# EAGLE schematic MainECU rev11 (EAGLE 9.6.2)

## Sheet 1 of 6
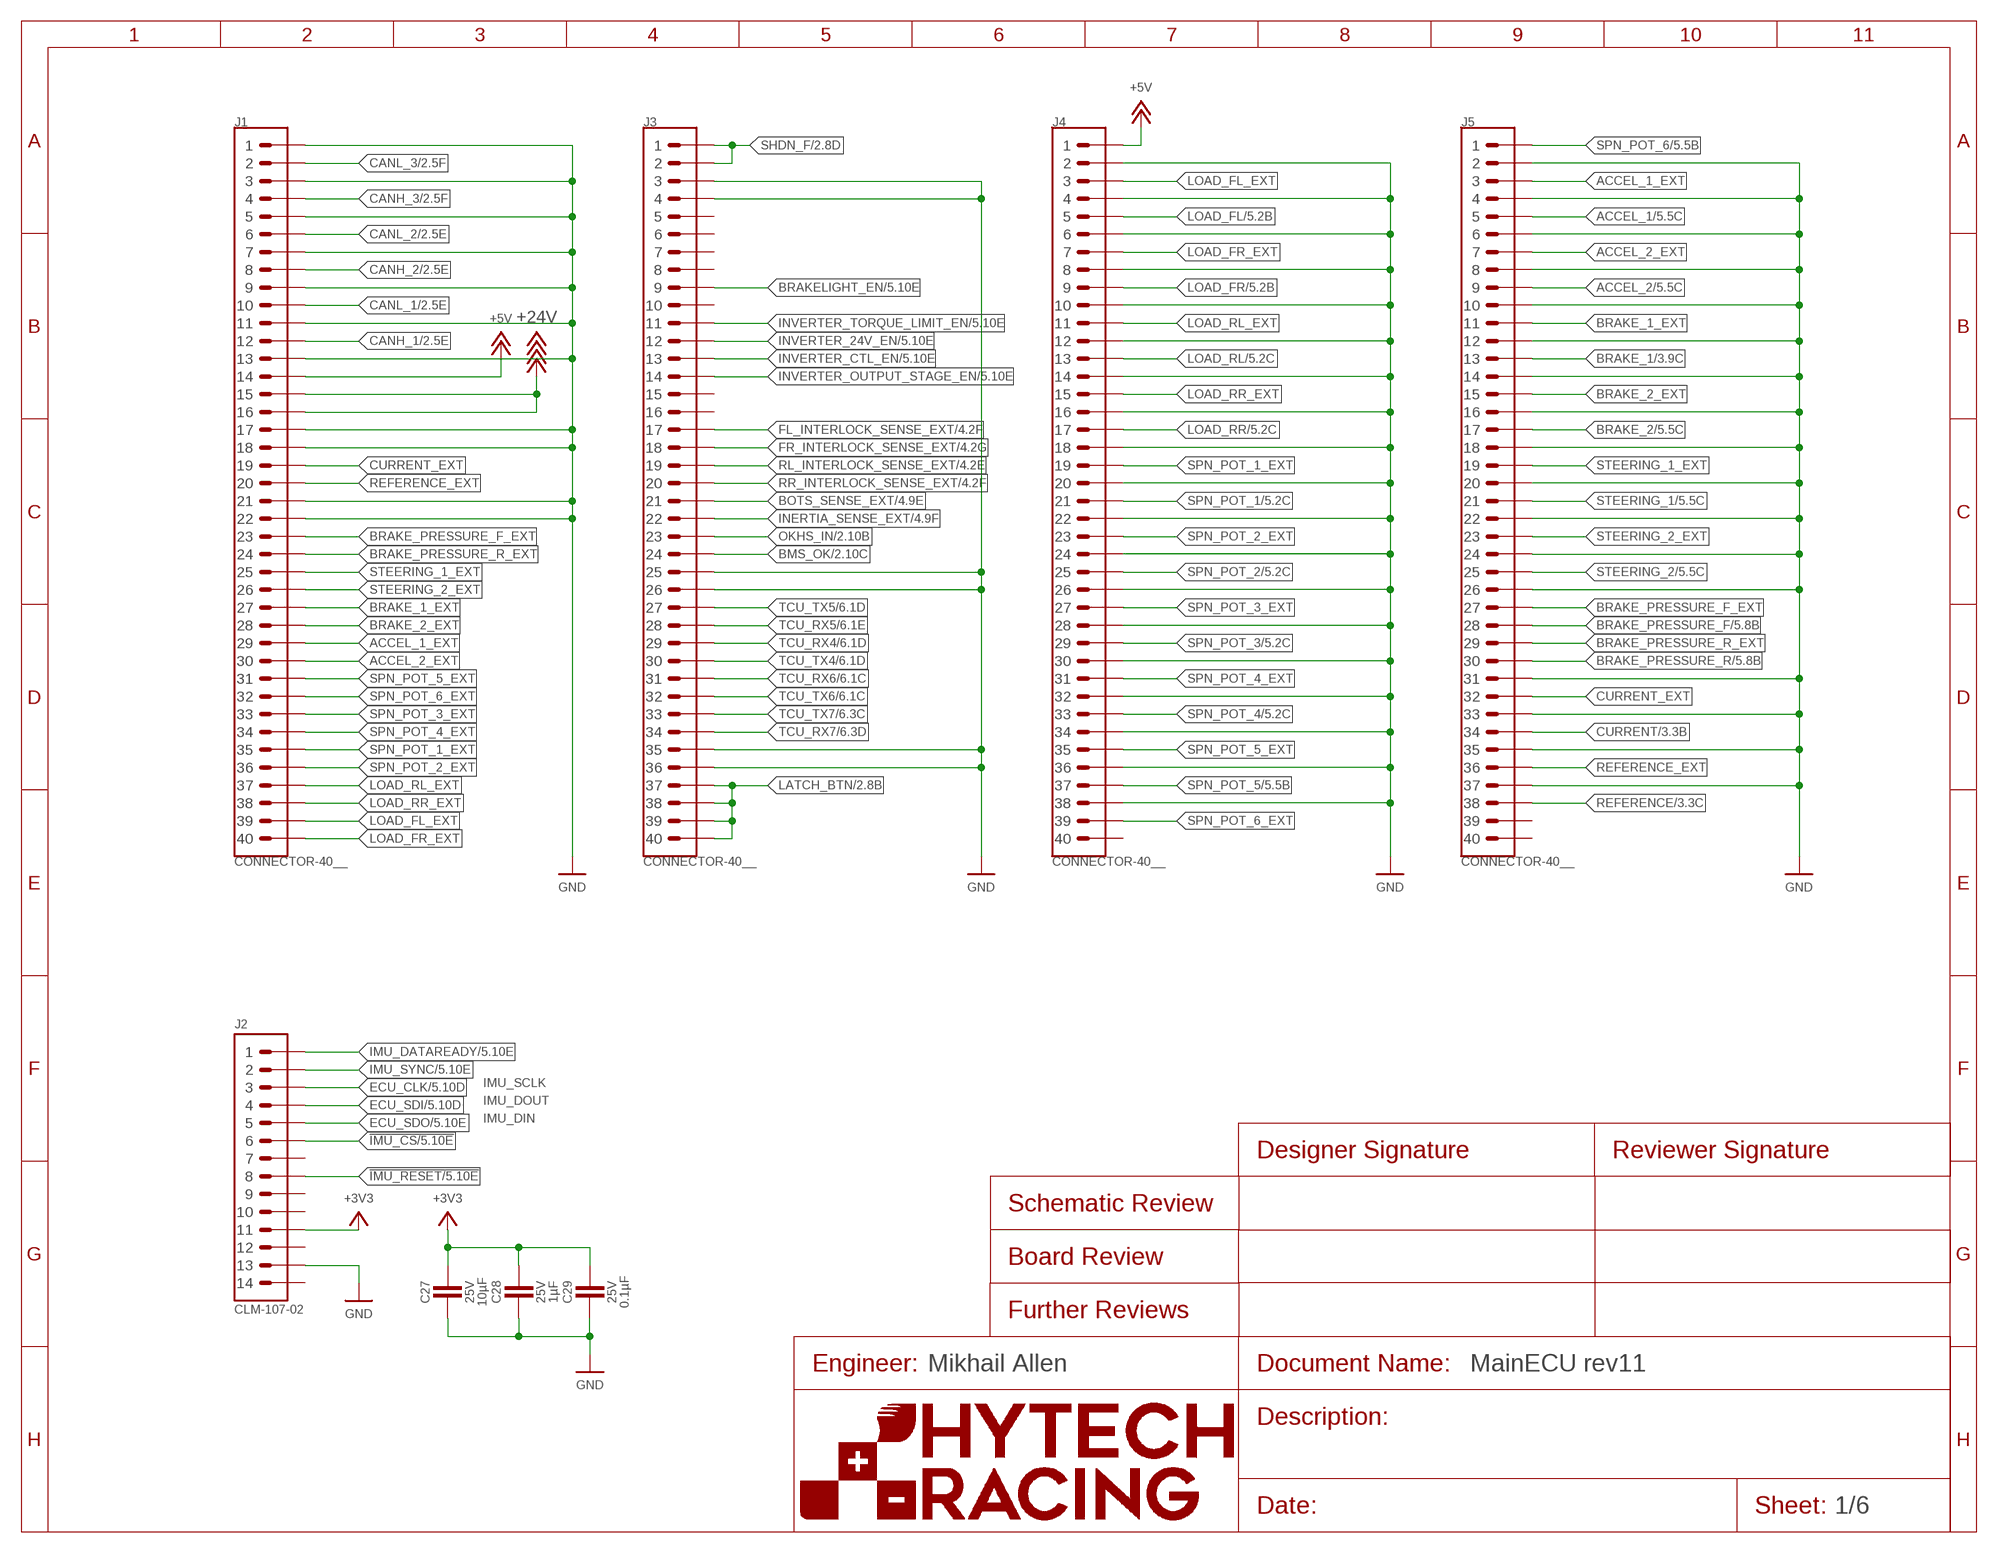
[diagram p0: schematic, sheet 1]
FRAME8 (FRAME): ENGINEER: Mikhail Allen

### Parts
C27  CAPACITOR_0603_25V_10UF  [0603-CAP]
C28  CAPACITOR_0603_25V_1UF  [0603-CAP]
C29  CAPACITOR_0603_25V_0.1UF  [0603-CAP]
J1  CONNECTOR-40__  [EHT-120-01]
J2  ADIS16460  [ADIS16460]
J3  CONNECTOR-40__  [EHT-120-01]
J4  CONNECTOR-40__  [EHT-120-01]
J5  CONNECTOR-40__  [EHT-120-01]

### Nets
!IMU_CS: J2.6 ; also sheet 5
!IMU_RESET: J2.8 ; also sheet 5
+3V3: C27.1 C28.1 C29.1 J2.11 ; also sheet 2,4,5,6
+5V: J1.14 J4.1 ; also sheet 2,3,5,6
+24V: J1.15 J1.16 ; also sheet 2,3,4,6
ACCEL_1: J5.5 ; also sheet 5
ACCEL_1_EXT: J1.29 J5.3
ACCEL_2: J5.9 ; also sheet 5
ACCEL_2_EXT: J1.30 J5.7
BMS_OK: J3.24 ; also sheet 2,4
BOTS_SENSE_EXT: J3.21 ; also sheet 4
BRAKE_1: J5.13 ; also sheet 3,5
BRAKE_1_EXT: J1.27 J5.11
BRAKE_2: J5.17 ; also sheet 5
BRAKE_2_EXT: J1.28 J5.15
BRAKE_PRESSURE_F: J5.28 ; also sheet 5
BRAKE_PRESSURE_F_EXT: J1.23 J5.27
BRAKE_PRESSURE_R: J5.30 ; also sheet 5
BRAKE_PRESSURE_R_EXT: J1.24 J5.29
BRAKELIGHT_EN: J3.9 ; also sheet 5
CANH_1: J1.12 ; also sheet 2,5,6
CANH_2: J1.8 ; also sheet 2,5,6
CANH_3: J1.4 ; also sheet 2,5,6
CANL_1: J1.10 ; also sheet 2,5,6
CANL_2: J1.6 ; also sheet 2,5,6
CANL_3: J1.2 ; also sheet 2,5,6
CURRENT: J5.34 ; also sheet 3,5,6
CURRENT_EXT: J1.19 J5.32
ECU_CLK: J2.3 ; also sheet 5
ECU_SDI: J2.4 ; also sheet 5
ECU_SDO: J2.5 ; also sheet 5
FL_INTERLOCK_SENSE_EXT: J3.17 ; also sheet 4
FR_INTERLOCK_SENSE_EXT: J3.18 ; also sheet 4
GND: C27.2 C28.2 C29.2 J1.1 J1.3 J1.5 J1.7 J1.9 J1.11 J1.13 J1.17 J1.18 J1.21 J1.22 J2.13 J3.3 J3.4 J3.25 J3.26 J3.35 J3.36 J4.2 J4.4 J4.6 J4.8 J4.10 J4.12 J4.14 J4.16 J4.18 J4.20 J4.22 J4.24 J4.26 J4.28 J4.30 J4.32 J4.34 J4.36 J4.38 J5.2 J5.4 J5.6 J5.8 J5.10 J5.12 J5.14 J5.16 J5.18 J5.20 J5.22 J5.24 J5.26 J5.31 J5.33 J5.35 J5.37 ; also sheet 2,3,4,5,6
IMU_DATAREADY: J2.1 ; also sheet 5
IMU_SYNC: J2.2 ; also sheet 5
INERTIA_SENSE_EXT: J3.22 ; also sheet 4
INVERTER_24V_EN: J3.12 ; also sheet 5
INVERTER_CTL_EN: J3.13 ; also sheet 5
INVERTER_OUTPUT_STAGE_EN: J3.14 ; also sheet 5
INVERTER_TORQUE_LIMIT_EN: J3.11 ; also sheet 5
LATCH_BTN: J3.37 J3.38 J3.39 J3.40 ; also sheet 2,4
LOAD_FL: J4.5 ; also sheet 5
LOAD_FL_EXT: J1.39 J4.3
LOAD_FR: J4.9 ; also sheet 5
LOAD_FR_EXT: J1.40 J4.7
LOAD_RL: J4.13 ; also sheet 5
LOAD_RL_EXT: J1.37 J4.11
LOAD_RR: J4.17 ; also sheet 5
LOAD_RR_EXT: J1.38 J4.15
OKHS_IN: J3.23 ; also sheet 2,4
REFERENCE: J5.38 ; also sheet 3,5,6
REFERENCE_EXT: J1.20 J5.36
RL_INTERLOCK_SENSE_EXT: J3.19 ; also sheet 4
RR_INTERLOCK_SENSE_EXT: J3.20 ; also sheet 4
SHDN_F: J3.1 J3.2 ; also sheet 2,4
SPN_POT_1: J4.21 ; also sheet 5
SPN_POT_1_EXT: J1.35 J4.19
SPN_POT_2: J4.25 ; also sheet 5
SPN_POT_2_EXT: J1.36 J4.23
SPN_POT_3: J4.29 ; also sheet 5
SPN_POT_3_EXT: J1.33 J4.27
SPN_POT_4: J4.33 ; also sheet 5
SPN_POT_4_EXT: J1.34 J4.31
SPN_POT_5: J4.37 ; also sheet 5
SPN_POT_5_EXT: J1.31 J4.35
SPN_POT_6: J5.1 ; also sheet 5
SPN_POT_6_EXT: J1.32 J4.39
STEERING_1: J5.21 ; also sheet 5
STEERING_1_EXT: J1.25 J5.19
STEERING_2: J5.25 ; also sheet 5
STEERING_2_EXT: J1.26 J5.23
TCU_RX4: J3.29 ; also sheet 6
TCU_RX5: J3.28 ; also sheet 6
TCU_RX6: J3.31 ; also sheet 6
TCU_RX7: J3.34 ; also sheet 6
TCU_TX4: J3.30 ; also sheet 6
TCU_TX5: J3.27 ; also sheet 6
TCU_TX6: J3.32 ; also sheet 6
TCU_TX7: J3.33 ; also sheet 6
Unconnected: J2.7 J2.9 J2.10 J2.12 J2.14 J3.5 J3.6 J3.7 J3.8 J3.10 J3.15 J3.16 J4.40 J5.39 J5.40

### Notes on the sheet
- IMU_SCLK
- IMU_DOUT
- IMU_DIN

## Sheet 2 of 6
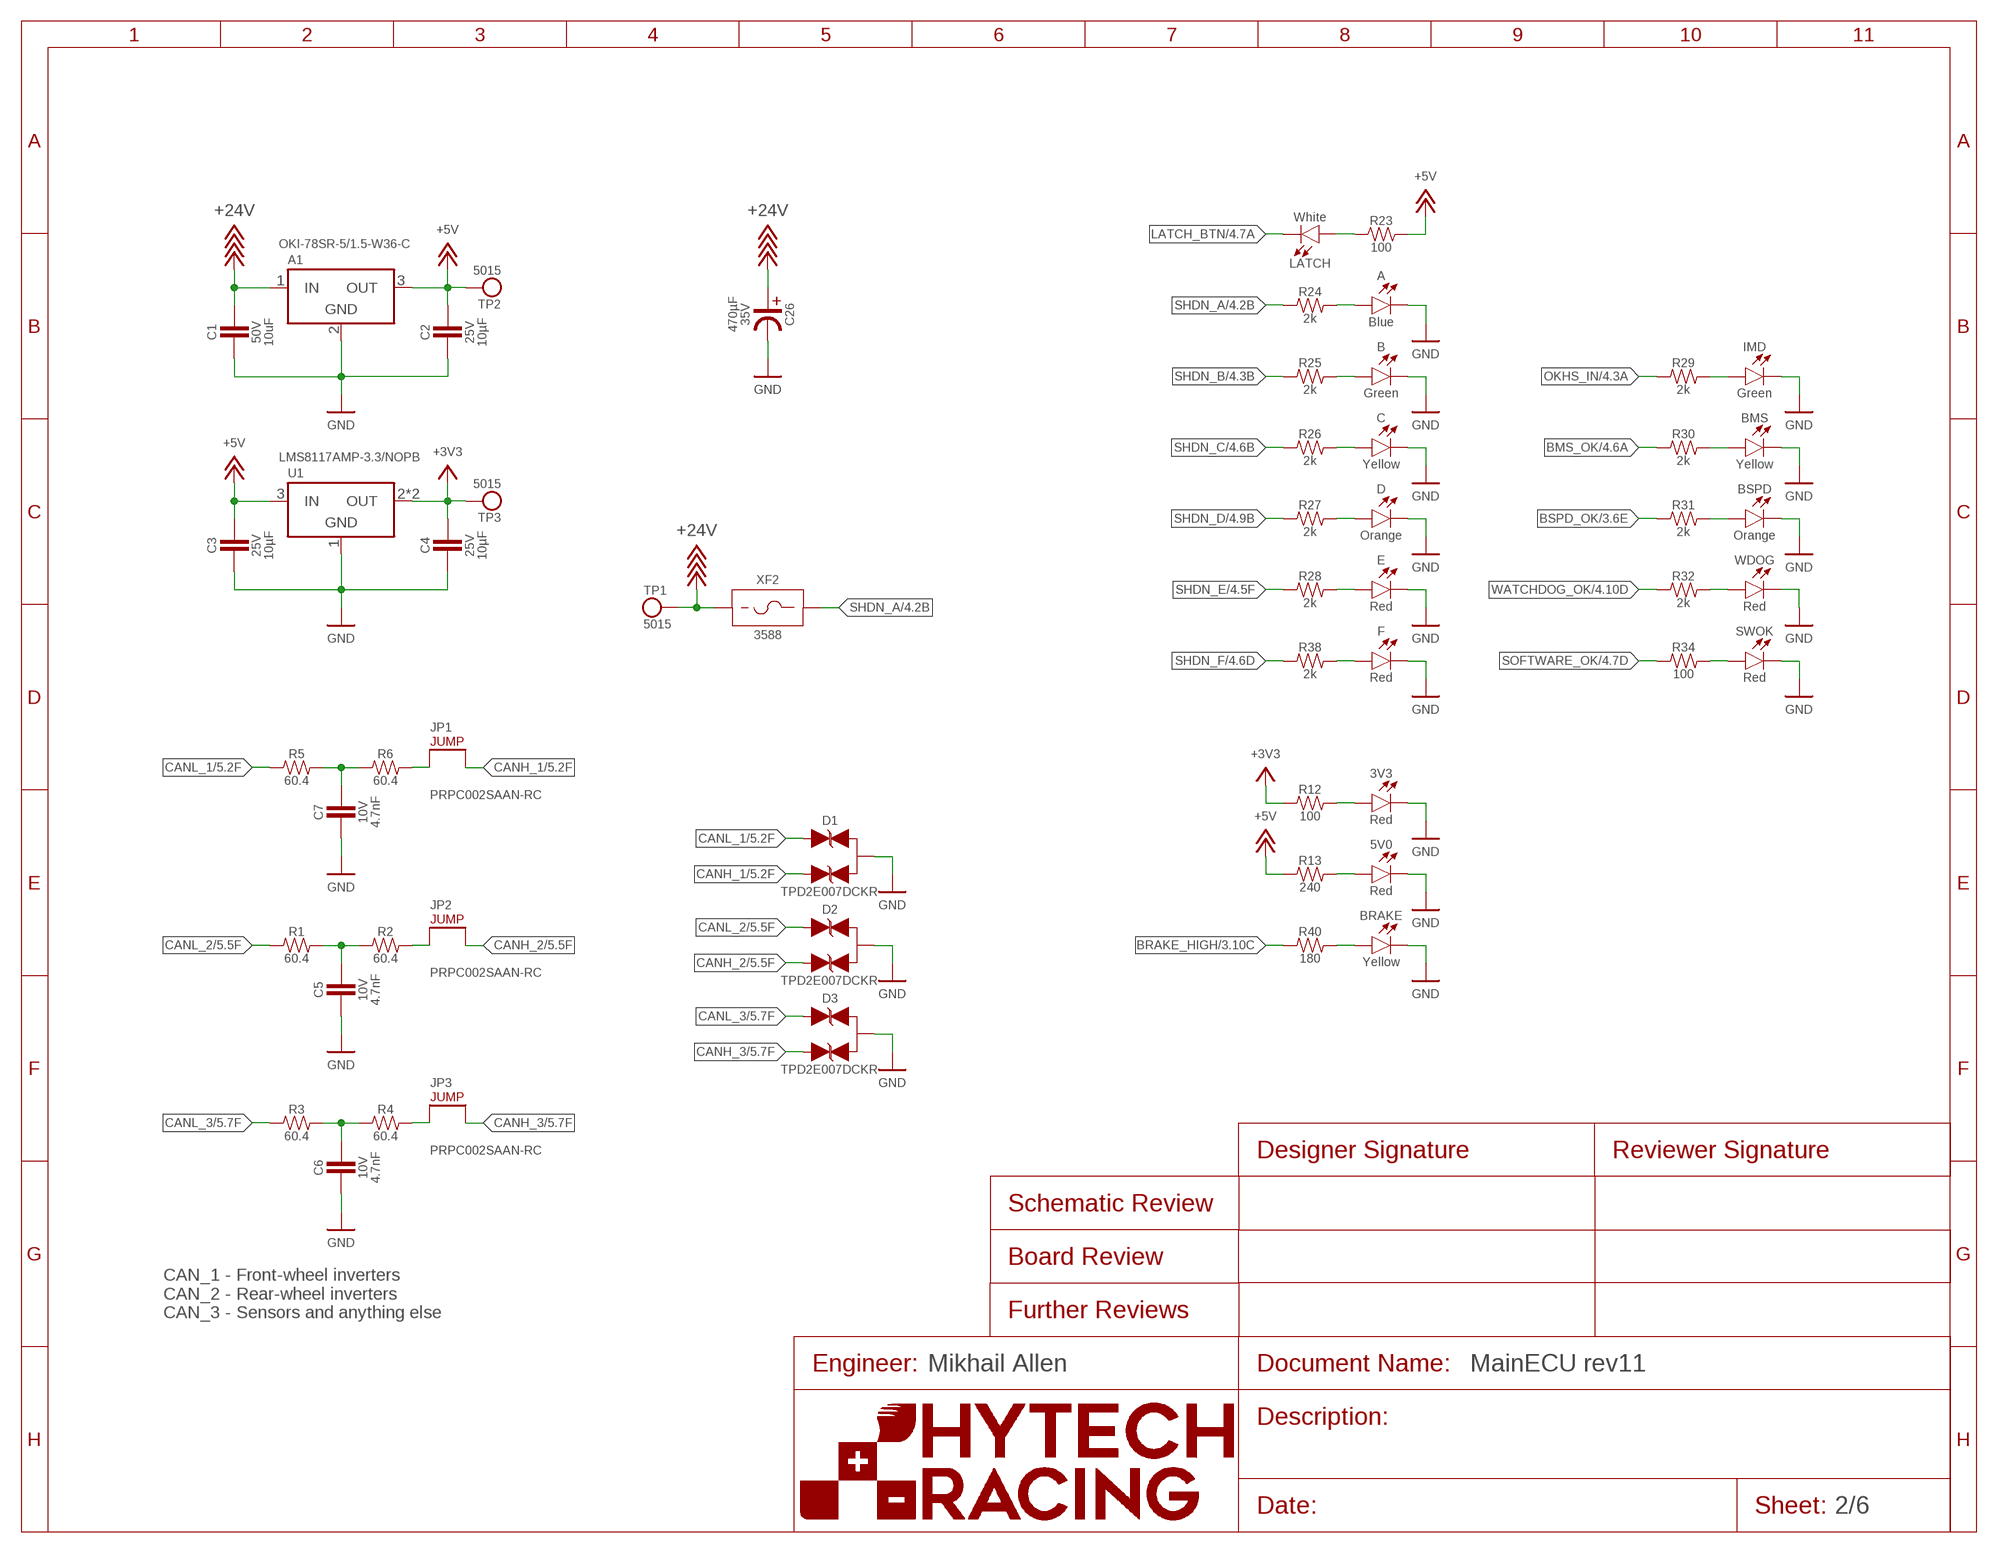
[diagram p1: schematic, sheet 2]
FRAME1 (FRAME): ENGINEER: Mikhail Allen

### Parts
3V3  LED_0603_RED  [0603-LED]
5V0  LED_0603_RED  [0603-LED]
A  LED_0603_BLUE  [0603-LED]
A1  VOLTAGE_REGULATOR_MODULE_OKI-78SR_5V  [OKI-78SR]
B  LED_0603_GREEN  [0603-LED]
BMS  LED_0603_YELLOW  [0603-LED]
BRAKE  LED_0603_YELLOW  [0603-LED]
BSPD  LED_0603_ORANGE  [0603-LED]
C  LED_0603_YELLOW  [0603-LED]
C1  CAPACITOR_0805_50V_10UF  [0805-CAP]
C2  CAPACITOR_0603_25V_10UF  [0603-CAP]
C3  CAPACITOR_0603_25V_10UF  [0603-CAP]
C4  CAPACITOR_0603_25V_10UF  [0603-CAP]
C5  CAPACITOR_0603_10V_4.7NF  [0603-CAP]
C6  CAPACITOR_0603_10V_4.7NF  [0603-CAP]
C7  CAPACITOR_0603_10V_4.7NF  [0603-CAP]
C26  EEH-AZS1V471B  [EEH-AZS]
D  LED_0603_ORANGE  [0603-LED]
D1  TVS_BIDIRECTIONAL_DUAL  [SC-70-3]
D2  TVS_BIDIRECTIONAL_DUAL  [SC-70-3]
D3  TVS_BIDIRECTIONAL_DUAL  [SC-70-3]
E  LED_0603_RED  [0603-LED]
F  LED_0603_RED  [0603-LED]
IMD  LED_0603_GREEN  [0603-LED]
JP1  JUMPER__1X02  [1X02]
JP2  JUMPER__1X02  [1X02]
JP3  JUMPER__1X02  [1X02]
LATCH  LED_0603_WHITE  [0603-LED]
R1  RESISTOR_0603_60.4  [0603-RES]
R2  RESISTOR_0603_60.4  [0603-RES]
R3  RESISTOR_0603_60.4  [0603-RES]
R4  RESISTOR_0603_60.4  [0603-RES]
R5  RESISTOR_0603_60.4  [0603-RES]
R6  RESISTOR_0603_60.4  [0603-RES]
R12  RESISTOR_0603_100  [0603-RES]
R13  RESISTOR_0603_240  [0603-RES]
R23  RESISTOR_0603_100  [0603-RES]
R24  RESISTOR_0603_2K  [0603-RES]
R25  RESISTOR_0603_2K  [0603-RES]
R26  RESISTOR_0603_2K  [0603-RES]
R27  RESISTOR_0603_2K  [0603-RES]
R28  RESISTOR_0603_2K  [0603-RES]
R29  RESISTOR_0603_2K  [0603-RES]
R30  RESISTOR_0603_2K  [0603-RES]
R31  RESISTOR_0603_2K  [0603-RES]
R32  RESISTOR_0603_2K  [0603-RES]
R34  RESISTOR_0603_100  [0603-RES]
R38  RESISTOR_0603_2K  [0603-RES]
R40  RESISTOR_0603_180  [0603-RES]
SWOK  LED_0603_RED  [0603-LED]
TP1  TEST_POINT  [5015]
TP2  TEST_POINT  [5015]
TP3  TEST_POINT  [5015]
U1  VOLTAGE_REGULATOR_SOT-223_3.3V  [SOT-223]
WDOG  LED_0603_RED  [0603-LED]
XF2  FUSE_HOLDER_MINIBLADESMD  [3588]

### Nets
+3V3: C4.1 R12.1 TP3.1 U1.2(OUT) U1.4(OUT) ; also sheet 1,4,5,6
+5V: A1.3(OUT) C2.1 C3.1 R13.1 R23.2 TP2.1 U1.3(IN) ; also sheet 1,3,5,6
+24V: A1.1(IN) C1.1 C26.PLUS TP1.1 XF2.1 XF2.2 ; also sheet 1,3,4,6
BMS_OK: R30.1 ; also sheet 1,4
BRAKE_HIGH: R40.1 ; also sheet 3
BSPD_OK: R31.1 ; also sheet 3,4
CANH_1: D1.2(C2) JP1.2 ; also sheet 1,5,6
CANH_2: D2.2(C2) JP2.2 ; also sheet 1,5,6
CANH_3: D3.2(C2) JP3.2 ; also sheet 1,5,6
CANL_1: D1.1(C1) R5.1 ; also sheet 1,5,6
CANL_2: D2.1(C1) R1.1 ; also sheet 1,5,6
CANL_3: D3.1(C1) R3.1 ; also sheet 1,5,6
GND: 3V3.1(C) 5V0.1(C) A1.2(GND) A.1(C) B.1(C) BMS.1(C) BRAKE.1(C) BSPD.1(C) C1.2 C2.2 C3.2 C4.2 C5.2 C6.2 C7.2 C26.MINUS C.1(C) D1.3(A) D2.3(A) D3.3(A) D.1(C) E.1(C) F.1(C) IMD.1(C) SWOK.1(C) U1.1(GND) WDOG.1(C) ; also sheet 1,3,4,5,6
LATCH_BTN: LATCH.1(C) ; also sheet 1,4
N$1: JP1.1 R6.2
N$2: JP2.1 R2.2
N$6: JP3.1 R4.2
N$7: C5.1 R1.2 R2.1
N$8: C6.1 R3.2 R4.1
N$9: C7.1 R5.2 R6.1
N$13: F.2(A) R38.2
N$15: LATCH.2(A) R23.1
N$16: A.2(A) R24.2
N$17: B.2(A) R25.2
N$18: C.2(A) R26.2
N$19: D.2(A) R27.2
N$20: E.2(A) R28.2
N$40: IMD.2(A) R29.2
N$41: BMS.2(A) R30.2
N$42: BSPD.2(A) R31.2
N$43: R32.2 WDOG.2(A)
N$44: 3V3.2(A) R12.2
N$45: R34.2 SWOK.2(A)
N$47: 5V0.2(A) R13.2
N$56: BRAKE.2(A) R40.2
OKHS_IN: R29.1 ; also sheet 1,4
SHDN_A: R24.1 XF2.3 XF2.4 ; also sheet 4
SHDN_B: R25.1 ; also sheet 4
SHDN_C: R26.1 ; also sheet 4
SHDN_D: R27.1 ; also sheet 4
SHDN_E: R28.1 ; also sheet 4
SHDN_F: R38.1 ; also sheet 1,4
SOFTWARE_OK: R34.1 ; also sheet 4,5
WATCHDOG_OK: R32.1 ; also sheet 4

### Notes on the sheet
- CAN_1 - Front-wheel inverters
  CAN_2 - Rear-wheel inverters
  CAN_3 - Sensors and anything else

## Sheet 3 of 6
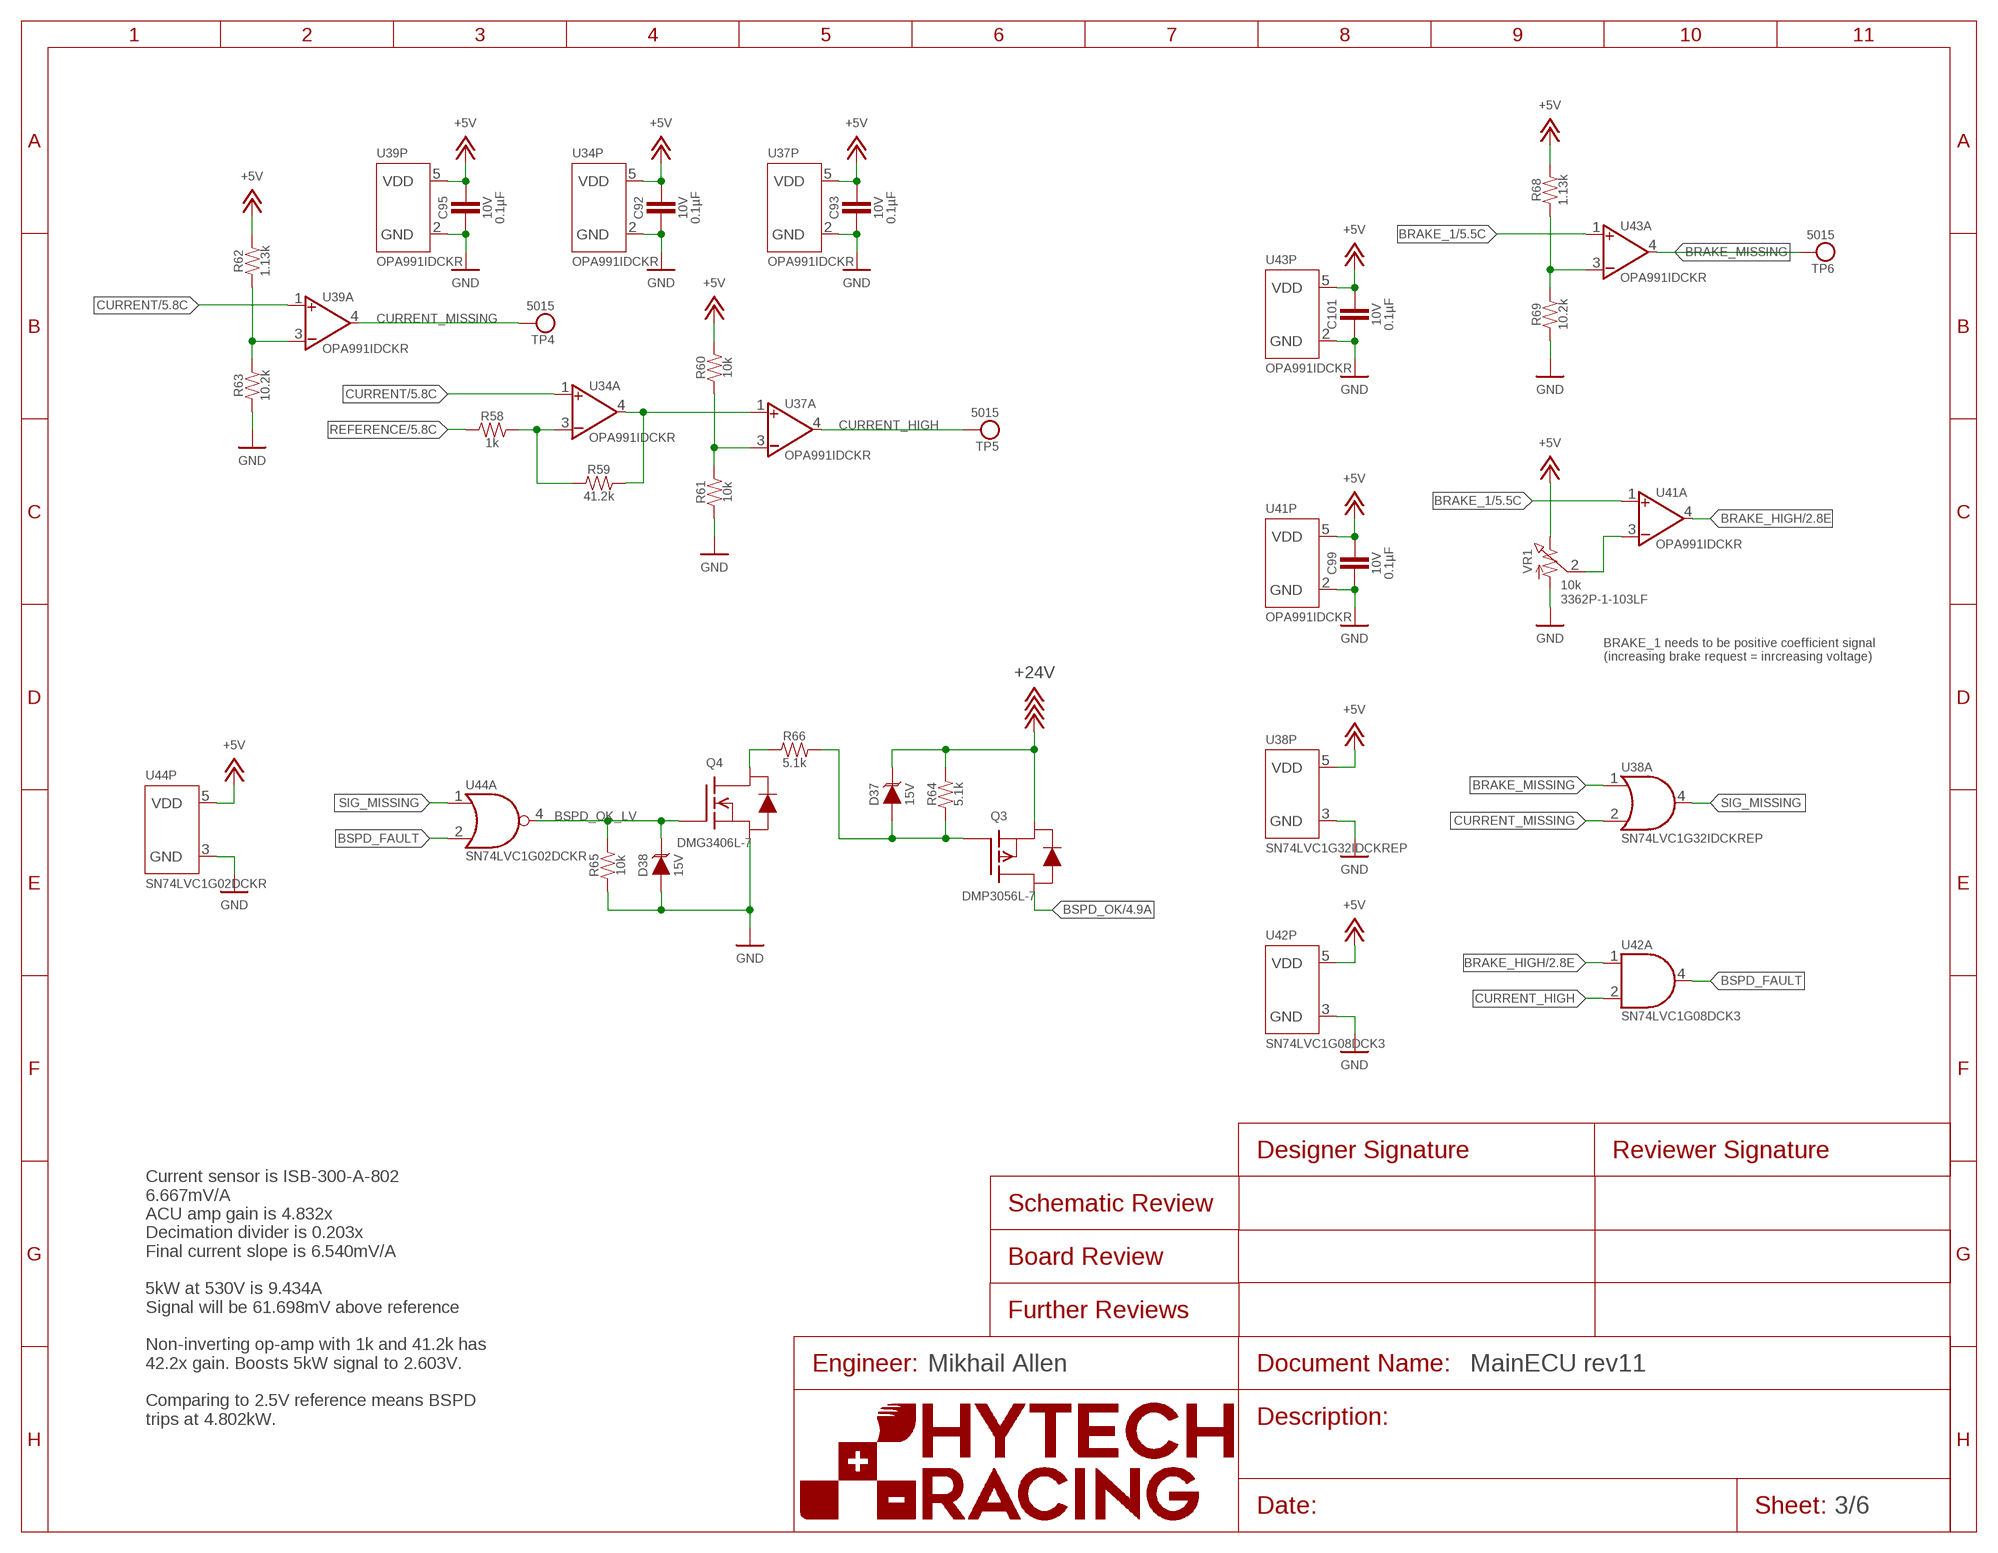
[diagram p2: schematic, sheet 3]
FRAME7 (FRAME): ENGINEER: Mikhail Allen

### Parts
C92  CAPACITOR_0603_10V_0.1UF  [0603-CAP]
C93  CAPACITOR_0603_10V_0.1UF  [0603-CAP]
C95  CAPACITOR_0603_10V_0.1UF  [0603-CAP]
C99  CAPACITOR_0603_10V_0.1UF  [0603-CAP]
C101  CAPACITOR_0603_10V_0.1UF  [0603-CAP]
D37  TVS_15V  [SOT-23]
D38  TVS_15V  [SOT-23]
Q3  TRANSISTOR_P_MOS_SOT-23_DMP3056L-7  [SOT-23]
Q4  TRANSISTOR_N_MOS__DMG3406L-7  [SOT-23]
R58  RESISTOR_0603_1K  [0603-RES]
R59  RESISTOR_0603_41.2K  [0603-RES]
R60  RESISTOR_0603_10K  [0603-RES]
R61  RESISTOR_0603_10K  [0603-RES]
R62  RESISTOR_0603_1.13K  [0603-RES]
R63  RESISTOR_0603_10.2K  [0603-RES]
R64  RESISTOR_0603_5.1K  [0603-RES]
R65  RESISTOR_0603_10K  [0603-RES]
R66  RESISTOR_0603_5.1K  [0603-RES]
R68  RESISTOR_0603_1.13K  [0603-RES]
R69  RESISTOR_0603_10.2K  [0603-RES]
TP4  TEST_POINT  [5015]
TP5  TEST_POINT  [5015]
TP6  TEST_POINT  [5015]
U34  OPAMP_1_CHANNEL_OPA991  [SC-70-5]
U37  OPAMP_1_CHANNEL_OPA991  [SC-70-5]
U38  LOGICGATE_OR  [SC-70-5]
U39  OPAMP_1_CHANNEL_OPA991  [SC-70-5]
U41  OPAMP_1_CHANNEL_OPA991  [SC-70-5]
U42  LOGICGATE_AND_DCK3  [SC-70-5]
U43  OPAMP_1_CHANNEL_OPA991  [SC-70-5]
U44  LOGICGATE_NOR  [SC-70-5]
VR1  RESISTOR_TRIMPOT_10K_3362P  [3362P]

### Nets
+5V: C92.1 C93.1 C95.1 C99.1 C101.1 R60.2 R62.2 R68.2 U34.5(P:VDD) U37.5(P:VDD) U38.5(P:VDD) U39.5(P:VDD) U41.5(P:VDD) U42.5(P:VDD) U43.5(P:VDD) U44.5(P:VDD) VR1.3 ; also sheet 1,2,5,6
+24V: D37.3(C) Q3.2(S) R64.2 ; also sheet 1,2,4,6
BRAKE_1: U41.1(A:VIN+) U43.1(A:VIN+) ; also sheet 1,5
BRAKE_HIGH: U41.4(A:VOUT) U42.1(A:IN1) ; also sheet 2
BRAKE_MISSING: TP6.1 U38.1(A:IN1) U43.4(A:VOUT)
BSPD_FAULT: U42.4(A:OUT) U44.2(A:IN2)
BSPD_OK: Q3.3(D) ; also sheet 2,4
BSPD_OK_LV: D38.3(C) Q4.1(G) R65.2 U44.4(A:OUT)
CURRENT: U34.1(A:VIN+) U39.1(A:VIN+) ; also sheet 1,5,6
CURRENT_HIGH: TP5.1 U37.4(A:VOUT) U42.2(A:IN2)
CURRENT_MISSING: TP4.1 U38.2(A:IN2) U39.4(A:VOUT)
GND: C92.2 C93.2 C95.2 C99.2 C101.2 D38.1(A) Q4.2(S) R61.1 R63.1 R65.1 R69.1 U34.2(P:GND) U37.2(P:GND) U38.3(P:GND) U39.2(P:GND) U41.2(P:GND) U42.3(P:GND) U43.2(P:GND) U44.3(P:GND) VR1.1 ; also sheet 1,2,4,5,6
N$65: R60.1 R61.2 U37.3(A:VIN-)
N$67: R58.2 R59.1 U34.3(A:VIN-)
N$68: R59.2 U34.4(A:VOUT) U37.1(A:VIN+)
N$72: R62.1 R63.2 U39.3(A:VIN-)
N$73: U41.3(A:VIN-) VR1.2
N$74: D37.1(A) Q3.1(G) R64.1 R66.2
N$75: Q4.3(D) R66.1
N$76: R68.1 R69.2 U43.3(A:VIN-)
REFERENCE: R58.1 ; also sheet 1,5,6
SIG_MISSING: U38.4(A:OUT) U44.1(A:IN1)

### Notes on the sheet
- BRAKE_1 needs to be positive coefficient signal
  (increasing brake request = inrcreasing voltage)
- Current sensor is ISB-300-A-802
  6.667mV/A
  ACU amp gain is 4.832x
  Decimation divider is 0.203x
  Final current slope is 6.540mV/A
  
  5kW at 530V is 9.434A
  Signal will be 61.698mV above reference
  
  Non-inverting op-amp with 1k and 41.2k has
  42.2x gain. Boosts 5kW signal to 2.603V.
  
  Comparing to 2.5V reference means BSPD
  trips at 4.802kW.

## Sheet 4 of 6
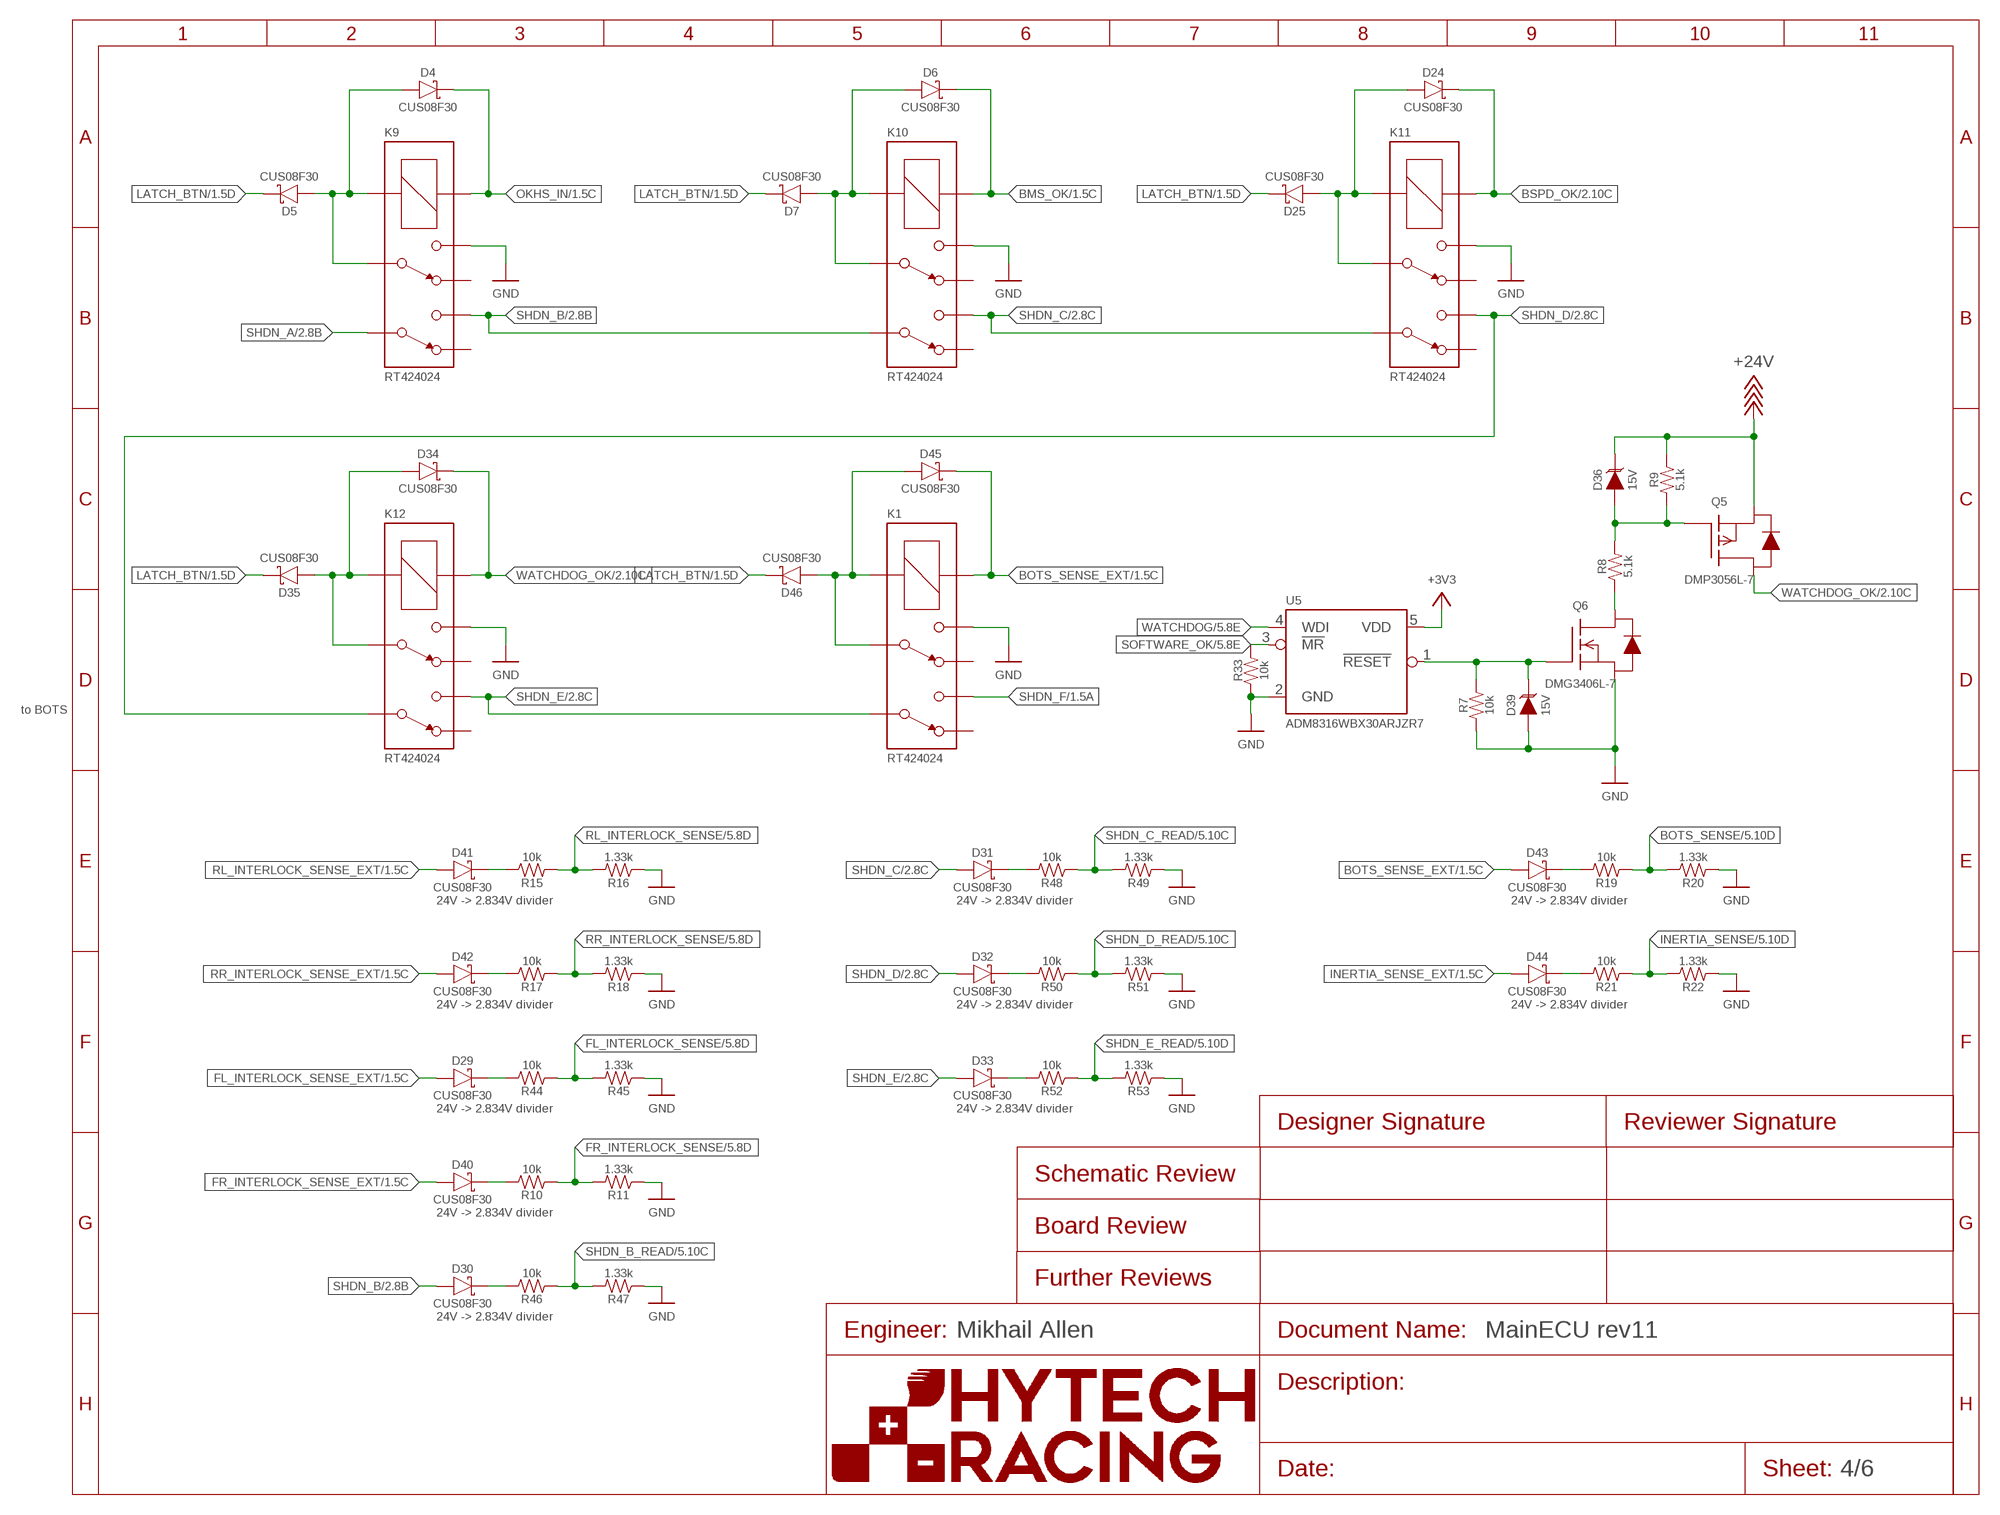
[diagram p3: schematic, sheet 4]
FRAME2 (FRAME): ENGINEER: Mikhail Allen

### Parts
D4  SCHOTTKY_SOD323_30V  [SOD-323]
D5  SCHOTTKY_SOD323_30V  [SOD-323]
D6  SCHOTTKY_SOD323_30V  [SOD-323]
D7  SCHOTTKY_SOD323_30V  [SOD-323]
D24  SCHOTTKY_SOD323_30V  [SOD-323]
D25  SCHOTTKY_SOD323_30V  [SOD-323]
D29  SCHOTTKY_SOD323_30V  [SOD-323]
D30  SCHOTTKY_SOD323_30V  [SOD-323]
D31  SCHOTTKY_SOD323_30V  [SOD-323]
D32  SCHOTTKY_SOD323_30V  [SOD-323]
D33  SCHOTTKY_SOD323_30V  [SOD-323]
D34  SCHOTTKY_SOD323_30V  [SOD-323]
D35  SCHOTTKY_SOD323_30V  [SOD-323]
D36  TVS_15V  [SOT-23]
D39  TVS_15V  [SOT-23]
D40  SCHOTTKY_SOD323_30V  [SOD-323]
D41  SCHOTTKY_SOD323_30V  [SOD-323]
D42  SCHOTTKY_SOD323_30V  [SOD-323]
D43  SCHOTTKY_SOD323_30V  [SOD-323]
D44  SCHOTTKY_SOD323_30V  [SOD-323]
D45  SCHOTTKY_SOD323_30V  [SOD-323]
D46  SCHOTTKY_SOD323_30V  [SOD-323]
K1  RELAY_DPDT_RT424024  [RT*2*]
K9  RELAY_DPDT_RT424024  [RT*2*]
K10  RELAY_DPDT_RT424024  [RT*2*]
K11  RELAY_DPDT_RT424024  [RT*2*]
K12  RELAY_DPDT_RT424024  [RT*2*]
Q5  TRANSISTOR_P_MOS_SOT-23_DMP3056L-7  [SOT-23]
Q6  TRANSISTOR_N_MOS__DMG3406L-7  [SOT-23]
R7  RESISTOR_0603_10K  [0603-RES]
R8  RESISTOR_0603_5.1K  [0603-RES]
R9  RESISTOR_0603_5.1K  [0603-RES]
R10  RESISTOR_0603_10K  [0603-RES]
R11  RESISTOR_0603_1.33K  [0603-RES]
R15  RESISTOR_0603_10K  [0603-RES]
R16  RESISTOR_0603_1.33K  [0603-RES]
R17  RESISTOR_0603_10K  [0603-RES]
R18  RESISTOR_0603_1.33K  [0603-RES]
R19  RESISTOR_0603_10K  [0603-RES]
R20  RESISTOR_0603_1.33K  [0603-RES]
R21  RESISTOR_0603_10K  [0603-RES]
R22  RESISTOR_0603_1.33K  [0603-RES]
R33  RESISTOR_0603_10K  [0603-RES]
R44  RESISTOR_0603_10K  [0603-RES]
R45  RESISTOR_0603_1.33K  [0603-RES]
R46  RESISTOR_0603_10K  [0603-RES]
R47  RESISTOR_0603_1.33K  [0603-RES]
R48  RESISTOR_0603_10K  [0603-RES]
R49  RESISTOR_0603_1.33K  [0603-RES]
R50  RESISTOR_0603_10K  [0603-RES]
R51  RESISTOR_0603_1.33K  [0603-RES]
R52  RESISTOR_0603_10K  [0603-RES]
R53  RESISTOR_0603_1.33K  [0603-RES]
U5  ADM8316WBX30  [SOT-23-5]

### Nets
+3V3: U5.5(VDD) ; also sheet 1,2,5,6
+24V: D36.3(C) Q5.2(S) R9.2 ; also sheet 1,2,3,6
BMS_OK: D6.C K10.A1(COIL+) ; also sheet 1,2
BOTS_SENSE: R19.1 R20.2 ; also sheet 5
BOTS_SENSE_EXT: D43.A D45.C K1.A1(COIL+) ; also sheet 1
BSPD_OK: D24.C K11.A1(COIL+) ; also sheet 2,3
FL_INTERLOCK_SENSE: R44.1 R45.2 ; also sheet 5
FL_INTERLOCK_SENSE_EXT: D29.A ; also sheet 1
FR_INTERLOCK_SENSE: R10.1 R11.2 ; also sheet 5
FR_INTERLOCK_SENSE_EXT: D40.A ; also sheet 1
GND: D39.1(A) K1.14 K9.14 K10.14 K11.14 K12.14 Q6.2(S) R7.1 R11.1 R16.1 R18.1 R20.1 R22.1 R33.1 R45.1 R47.1 R49.1 R51.1 R53.1 U5.2(GND) ; also sheet 1,2,3,5,6
INERTIA_SENSE: R21.1 R22.2 ; also sheet 5
INERTIA_SENSE_EXT: D44.A ; also sheet 1
LATCH_BTN: D5.C D7.C D25.C D35.C D46.C ; also sheet 1,2
N$3: D40.C R10.2
N$4: D36.1(A) Q5.1(G) R8.2 R9.1
N$5: Q6.3(D) R8.1
N$10: D41.C R15.2
N$11: D42.C R17.2
N$12: D43.C R19.2
N$14: D44.C R21.2
N$21: D4.A D5.A K9.11 K9.A2(COIL-)
N$22: D24.A D25.A K11.11 K11.A2(COIL-)
N$23: D6.A D7.A K10.11 K10.A2(COIL-)
N$24: D45.A D46.A K1.11 K1.A2(COIL-)
N$25: D34.A D35.A K12.11 K12.A2(COIL-)
N$58: D29.C R44.2
N$59: D30.C R46.2
N$60: D31.C R48.2
N$61: D32.C R50.2
N$62: D33.C R52.2
OKHS_IN: D4.C K9.A1(COIL+) ; also sheet 1,2
RL_INTERLOCK_SENSE: R15.1 R16.2 ; also sheet 5
RL_INTERLOCK_SENSE_EXT: D41.A ; also sheet 1
RR_INTERLOCK_SENSE: R17.1 R18.2 ; also sheet 5
RR_INTERLOCK_SENSE_EXT: D42.A ; also sheet 1
SHDN_A: K9.21 ; also sheet 2
SHDN_B: D30.A K9.24 K10.21 ; also sheet 2
SHDN_B_READ: R46.1 R47.2 ; also sheet 5
SHDN_C: D31.A K10.24 K11.21 ; also sheet 2
SHDN_C_READ: R48.1 R49.2 ; also sheet 5
SHDN_D: D32.A K11.24 K12.21 ; also sheet 2
SHDN_D_READ: R50.1 R51.2 ; also sheet 5
SHDN_E: D33.A K1.21 K12.24 ; also sheet 2
SHDN_E_READ: R52.1 R53.2 ; also sheet 5
SHDN_F: K1.24 ; also sheet 1,2
SOFTWARE_OK: R33.2 U5.3(!MR!) ; also sheet 2,5
WATCHDOG: U5.4(WDI) ; also sheet 5
WATCHDOG_OK: D34.C K12.A1(COIL+) Q5.3(D) ; also sheet 2
WATCHDOG_OK_LV: D39.3(C) Q6.1(G) R7.2 U5.1(!RESET!)
Unconnected: K1.12 K1.22 K9.12 K9.22 K10.12 K10.22 K11.12 K11.22 K12.12 K12.22

### Notes on the sheet
- to BOTS
- 24V -> 2.834V divider | 24V -> 2.834V divider | 24V -> 2.834V divider
- 24V -> 2.834V divider | 24V -> 2.834V divider | 24V -> 2.834V divider
- 24V -> 2.834V divider | 24V -> 2.834V divider
- 24V -> 2.834V divider
- 24V -> 2.834V divider

## Sheet 5 of 6
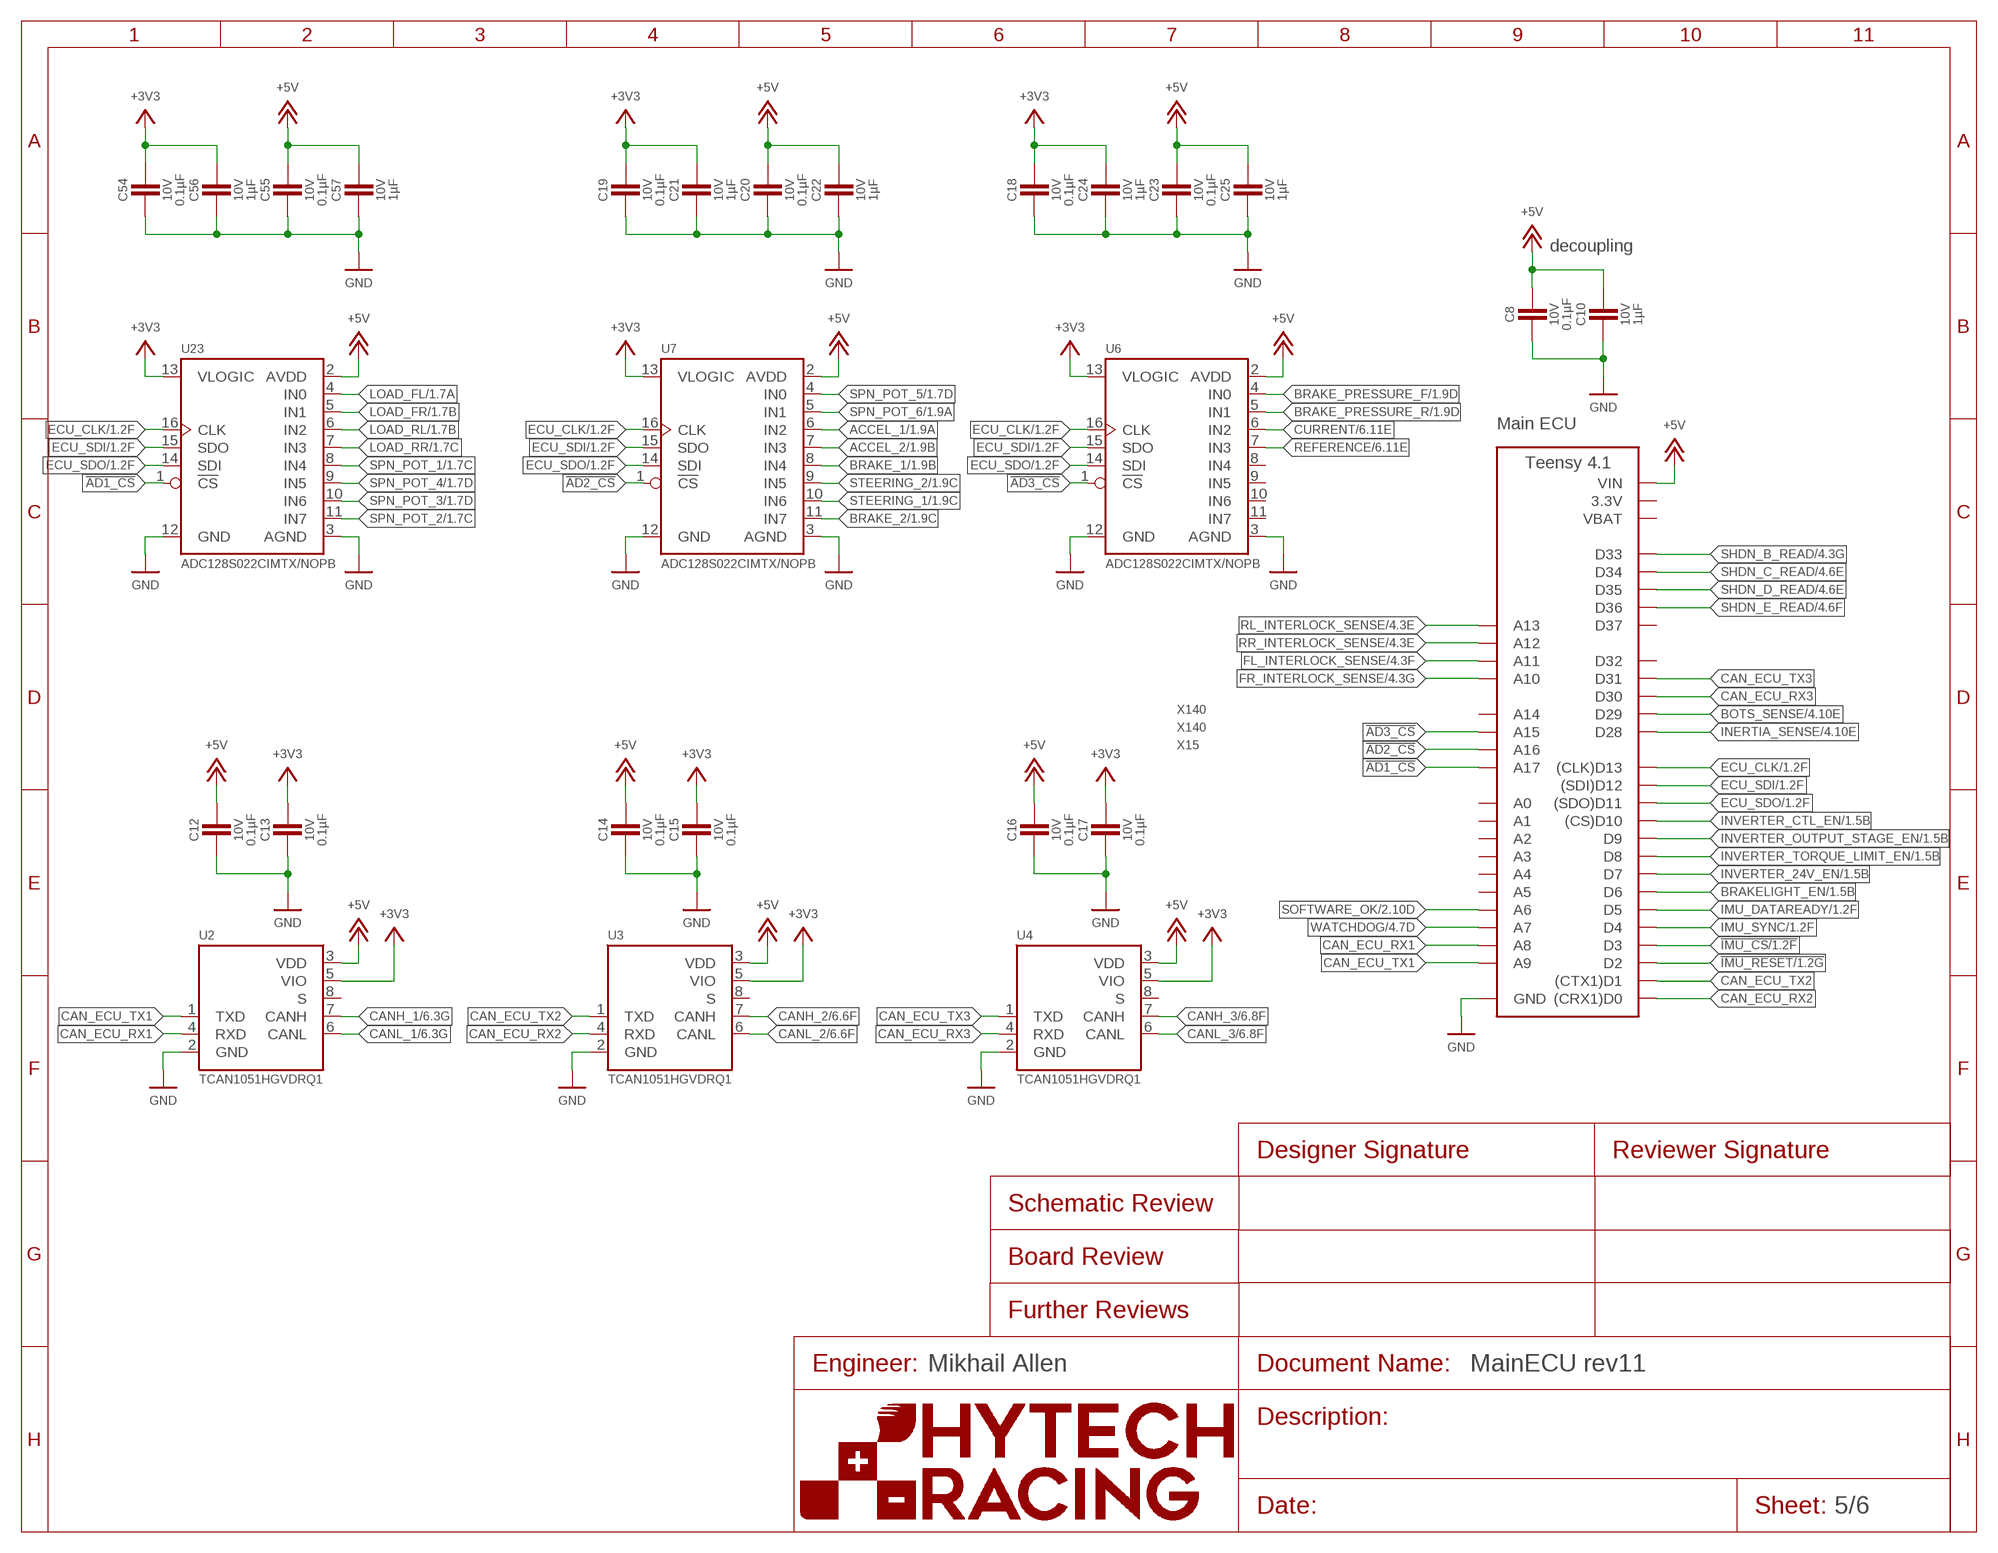
[diagram p4: schematic, sheet 5]
FRAME3 (FRAME): ENGINEER: Mikhail Allen

### Parts
A2  TEENSY_4.1  [TEENSY_LONG_EXT]
C8  CAPACITOR_0603_10V_0.1UF  [0603-CAP]
C10  CAPACITOR_0603_10V_1UF  [0603-CAP]
C12  CAPACITOR_0603_10V_0.1UF  [0603-CAP]
C13  CAPACITOR_0603_10V_0.1UF  [0603-CAP]
C14  CAPACITOR_0603_10V_0.1UF  [0603-CAP]
C15  CAPACITOR_0603_10V_0.1UF  [0603-CAP]
C16  CAPACITOR_0603_10V_0.1UF  [0603-CAP]
C17  CAPACITOR_0603_10V_0.1UF  [0603-CAP]
C18  CAPACITOR_0603_10V_0.1UF  [0603-CAP]
C19  CAPACITOR_0603_10V_0.1UF  [0603-CAP]
C20  CAPACITOR_0603_10V_0.1UF  [0603-CAP]
C21  CAPACITOR_0603_10V_1UF  [0603-CAP]
C22  CAPACITOR_0603_10V_1UF  [0603-CAP]
C23  CAPACITOR_0603_10V_0.1UF  [0603-CAP]
C24  CAPACITOR_0603_10V_1UF  [0603-CAP]
C25  CAPACITOR_0603_10V_1UF  [0603-CAP]
C54  CAPACITOR_0603_10V_0.1UF  [0603-CAP]
C55  CAPACITOR_0603_10V_0.1UF  [0603-CAP]
C56  CAPACITOR_0603_10V_1UF  [0603-CAP]
C57  CAPACITOR_0603_10V_1UF  [0603-CAP]
U2  TCAN1051HQV-Q1  [SOIC-08(NARROW,0.15")]
U3  TCAN1051HQV-Q1  [SOIC-08(NARROW,0.15")]
U4  TCAN1051HQV-Q1  [SOIC-08(NARROW,0.15")]
U6  ADC128S022  [TSSOP-16]
U7  ADC128S022  [TSSOP-16]
U23  ADC128S022  [TSSOP-16]

### Nets
!AD1_CS: A2.D41(A17) U23.1(!CS!)
!AD2_CS: A2.D40(A16) U7.1(!CS!)
!AD3_CS: A2.D39(A15) U6.1(!CS!)
!IMU_CS: A2.D3 ; also sheet 1
!IMU_RESET: A2.D2 ; also sheet 1
+3V3: C13.1 C15.1 C17.1 C18.1 C19.1 C21.1 C24.1 C54.1 C56.1 U2.5(VIO) U3.5(VIO) U4.5(VIO) U6.13(VLOGIC) U7.13(VLOGIC) U23.13(VLOGIC) ; also sheet 1,2,4,6
+5V: A2.VIN C8.1 C10.1 C12.1 C14.1 C16.1 C20.1 C22.1 C23.1 C25.1 C55.1 C57.1 U2.3(VDD) U3.3(VDD) U4.3(VDD) U6.2(AVDD) U7.2(AVDD) U23.2(AVDD) ; also sheet 1,2,3,6
ACCEL_1: U7.6(IN2) ; also sheet 1
ACCEL_2: U7.7(IN3) ; also sheet 1
BOTS_SENSE: A2.D29 ; also sheet 4
BRAKE_1: U7.8(IN4) ; also sheet 1,3
BRAKE_2: U7.11(IN7) ; also sheet 1
BRAKE_PRESSURE_F: U6.4(IN0) ; also sheet 1
BRAKE_PRESSURE_R: U6.5(IN1) ; also sheet 1
BRAKELIGHT_EN: A2.D6 ; also sheet 1
CAN_ECU_RX1: A2.D22(A8) U2.4(RXD)
CAN_ECU_RX2: A2.D0((CRX1)D0) U3.4(RXD)
CAN_ECU_RX3: A2.D30 U4.4(RXD)
CAN_ECU_TX1: A2.D23(A9) U2.1(TXD)
CAN_ECU_TX2: A2.D1((CTX1)D1) U3.1(TXD)
CAN_ECU_TX3: A2.D31 U4.1(TXD)
CANH_1: U2.7(CANH) ; also sheet 1,2,6
CANH_2: U3.7(CANH) ; also sheet 1,2,6
CANH_3: U4.7(CANH) ; also sheet 1,2,6
CANL_1: U2.6(CANL) ; also sheet 1,2,6
CANL_2: U3.6(CANL) ; also sheet 1,2,6
CANL_3: U4.6(CANL) ; also sheet 1,2,6
CURRENT: U6.6(IN2) ; also sheet 1,3,6
ECU_CLK: A2.D13((CLK)D13) U6.16(CLK) U7.16(CLK) U23.16(CLK) ; also sheet 1
ECU_SDI: A2.D12((SDI)D12) U6.15(SDO) U7.15(SDO) U23.15(SDO) ; also sheet 1
ECU_SDO: A2.D11((SDO)D11) U6.14(SDI) U7.14(SDI) U23.14(SDI) ; also sheet 1
FL_INTERLOCK_SENSE: A2.D25(A11) ; also sheet 4
FR_INTERLOCK_SENSE: A2.D24(A10) ; also sheet 4
GND: A2.AGND/GND(GND) A2.GND A2.GND@2(GND) C8.2 C10.2 C12.2 C13.2 C14.2 C15.2 C16.2 C17.2 C18.2 C19.2 C20.2 C21.2 C22.2 C23.2 C24.2 C25.2 C54.2 C55.2 C56.2 C57.2 U2.2(GND) U3.2(GND) U4.2(GND) U6.3(AGND) U6.12(GND) U7.3(AGND) U7.12(GND) U23.3(AGND) U23.12(GND) ; also sheet 1,2,3,4,6
IMU_DATAREADY: A2.D5 ; also sheet 1
IMU_SYNC: A2.D4 ; also sheet 1
INERTIA_SENSE: A2.D28 ; also sheet 4
INVERTER_24V_EN: A2.D7 ; also sheet 1
INVERTER_CTL_EN: A2.D10((CS)D10) ; also sheet 1
INVERTER_OUTPUT_STAGE_EN: A2.D9 ; also sheet 1
INVERTER_TORQUE_LIMIT_EN: A2.D8 ; also sheet 1
LOAD_FL: U23.4(IN0) ; also sheet 1
LOAD_FR: U23.5(IN1) ; also sheet 1
LOAD_RL: U23.6(IN2) ; also sheet 1
LOAD_RR: U23.7(IN3) ; also sheet 1
REFERENCE: U6.7(IN3) ; also sheet 1,3,6
RL_INTERLOCK_SENSE: A2.D27(A13) ; also sheet 4
RR_INTERLOCK_SENSE: A2.D26(A12) ; also sheet 4
SHDN_B_READ: A2.D33 ; also sheet 4
SHDN_C_READ: A2.D34 ; also sheet 4
SHDN_D_READ: A2.D35 ; also sheet 4
SHDN_E_READ: A2.D36 ; also sheet 4
SOFTWARE_OK: A2.D20(A6) ; also sheet 2,4
SPN_POT_1: U23.8(IN4) ; also sheet 1
SPN_POT_2: U23.11(IN7) ; also sheet 1
SPN_POT_3: U23.10(IN6) ; also sheet 1
SPN_POT_4: U23.9(IN5) ; also sheet 1
SPN_POT_5: U7.4(IN0) ; also sheet 1
SPN_POT_6: U7.5(IN1) ; also sheet 1
STEERING_1: U7.10(IN6) ; also sheet 1
STEERING_2: U7.9(IN5) ; also sheet 1
WATCHDOG: A2.D21(A7) ; also sheet 4
Unconnected: A2.D14(A0) A2.D15(A1) A2.D16(A2) A2.D17(A3) A2.D18(A4) A2.D19(A5) A2.D32 A2.D37 A2.D38(A14) U2.8(S) U3.8(S) U4.8(S) U6.8(IN4) U6.9(IN5) U6.10(IN6) U6.11(IN7)

### Notes on the sheet
- decoupling
- Main ECU
- X140
- X140
- X15

## Sheet 6 of 6
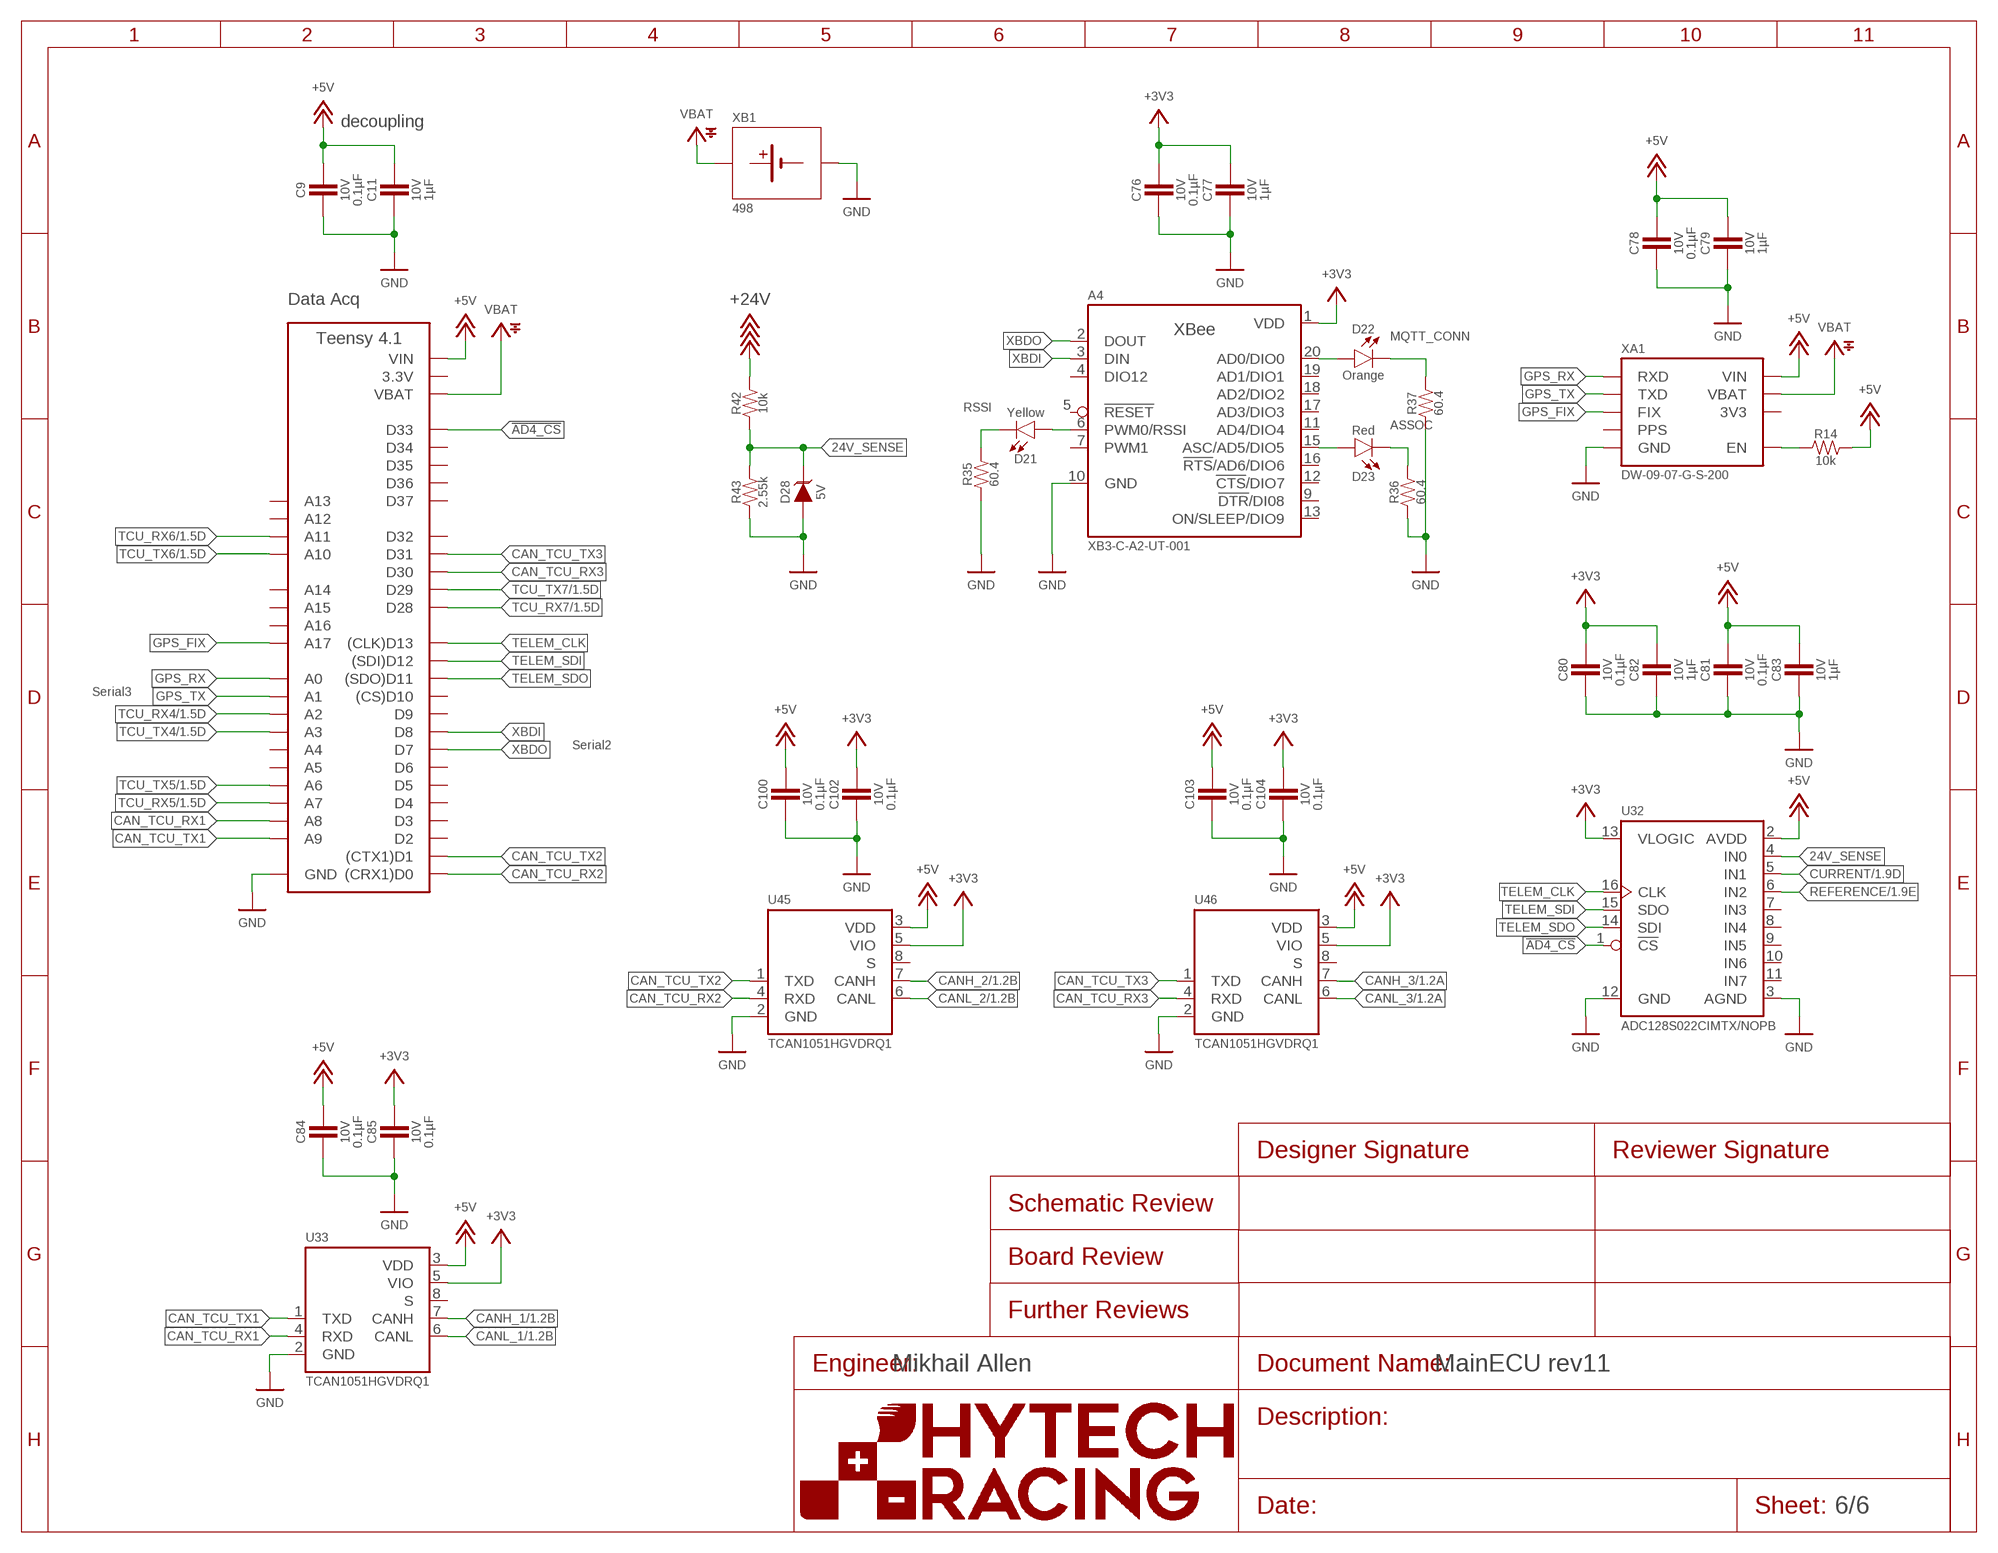
[diagram p5: schematic, sheet 6]
FRAME6 (FRAME): ENGINEER: Mikhail Allen

### Parts
A3  TEENSY_4.1  [TEENSY_LONG_EXT]
A4  XB3-C-A2-UT-001  [XBEE]
C9  CAPACITOR_0603_10V_0.1UF  [0603-CAP]
C11  CAPACITOR_0603_10V_1UF  [0603-CAP]
C76  CAPACITOR_0603_10V_0.1UF  [0603-CAP]
C77  CAPACITOR_0603_10V_1UF  [0603-CAP]
C78  CAPACITOR_0603_10V_0.1UF  [0603-CAP]
C79  CAPACITOR_0603_10V_1UF  [0603-CAP]
C80  CAPACITOR_0603_10V_0.1UF  [0603-CAP]
C81  CAPACITOR_0603_10V_0.1UF  [0603-CAP]
C82  CAPACITOR_0603_10V_1UF  [0603-CAP]
C83  CAPACITOR_0603_10V_1UF  [0603-CAP]
C84  CAPACITOR_0603_10V_0.1UF  [0603-CAP]
C85  CAPACITOR_0603_10V_0.1UF  [0603-CAP]
C100  CAPACITOR_0603_10V_0.1UF  [0603-CAP]
C102  CAPACITOR_0603_10V_0.1UF  [0603-CAP]
C103  CAPACITOR_0603_10V_0.1UF  [0603-CAP]
C104  CAPACITOR_0603_10V_0.1UF  [0603-CAP]
D21  LED_0603_YELLOW  [0603-LED]
D22  LED_0603_ORANGE  [0603-LED]
D23  LED_0603_RED  [0603-LED]
D28  TVS_5V  [SOT-23]
R14  RESISTOR_0603_10K  [0603-RES]
R35  RESISTOR_0603_60.4  [0603-RES]
R36  RESISTOR_0603_60.4  [0603-RES]
R37  RESISTOR_0603_60.4  [0603-RES]
R42  RESISTOR_0603_10K  [0603-RES]
R43  RESISTOR_0603_2.55K  [0603-RES]
U32  ADC128S022  [TSSOP-16]
U33  TCAN1051HQV-Q1  [SOIC-08(NARROW,0.15")]
U45  TCAN1051HQV-Q1  [SOIC-08(NARROW,0.15")]
U46  TCAN1051HQV-Q1  [SOIC-08(NARROW,0.15")]
XA1  ULTIMATE_GPS  [ULTIMATE_GPS]
XB1  BATTERY_HOLDER_KEYSTONE_498  [498]

### Nets
24V_SENSE: D28.3(C) R42.1 R43.2 U32.4(IN0)
!AD4_CS: A3.D33 U32.1(!CS!)
+3V3: A4.1(VDD) C76.1 C77.1 C80.1 C82.1 C85.1 C102.1 C104.1 U32.13(VLOGIC) U33.5(VIO) U45.5(VIO) U46.5(VIO) ; also sheet 1,2,4,5
+5V: A3.VIN C9.1 C11.1 C78.1 C79.1 C81.1 C83.1 C84.1 C100.1 C103.1 R14.2 U32.2(AVDD) U33.3(VDD) U45.3(VDD) U46.3(VDD) XA1.VIN ; also sheet 1,2,3,5
+24V: R42.2 ; also sheet 1,2,3,4
CAN_TCU_RX1: A3.D22(A8) U33.4(RXD)
CAN_TCU_RX2: A3.D0((CRX1)D0) U45.4(RXD)
CAN_TCU_RX3: A3.D30 U46.4(RXD)
CAN_TCU_TX1: A3.D23(A9) U33.1(TXD)
CAN_TCU_TX2: A3.D1((CTX1)D1) U45.1(TXD)
CAN_TCU_TX3: A3.D31 U46.1(TXD)
CANH_1: U33.7(CANH) ; also sheet 1,2,5
CANH_2: U45.7(CANH) ; also sheet 1,2,5
CANH_3: U46.7(CANH) ; also sheet 1,2,5
CANL_1: U33.6(CANL) ; also sheet 1,2,5
CANL_2: U45.6(CANL) ; also sheet 1,2,5
CANL_3: U46.6(CANL) ; also sheet 1,2,5
CURRENT: U32.5(IN1) ; also sheet 1,3,5
GND: A3.AGND/GND(GND) A3.GND A3.GND@2(GND) A4.10(GND) C9.2 C11.2 C76.2 C77.2 C78.2 C79.2 C80.2 C81.2 C82.2 C83.2 C84.2 C85.2 C100.2 C102.2 C103.2 C104.2 D28.1(A) R35.1 R36.1 R37.1 R43.1 U32.3(AGND) U32.12(GND) U33.2(GND) U45.2(GND) U46.2(GND) XA1.GND XB1.2(MINUS) ; also sheet 1,2,3,4,5
GPS_FIX: A3.D41(A17) XA1.FIX
GPS_RX: A3.D14(A0) XA1.RX(RXD)
GPS_TX: A3.D15(A1) XA1.TX(TXD)
N$48: D21.1(C) R35.2
N$49: A4.6(PWM0/RSSI) D21.2(A)
N$50: A4.20(AD0/DIO0) D22.2(A)
N$51: A4.15(ASC/AD5/DIO5) D23.2(A)
N$52: R14.1 XA1.EN
N$53: D22.1(C) R37.2
N$54: D23.1(C) R36.2
REFERENCE: U32.6(IN2) ; also sheet 1,3,5
TCU_RX4: A3.D16(A2) ; also sheet 1
TCU_RX5: A3.D21(A7) ; also sheet 1
TCU_RX6: A3.D25(A11) ; also sheet 1
TCU_RX7: A3.D28 ; also sheet 1
TCU_TX4: A3.D17(A3) ; also sheet 1
TCU_TX5: A3.D20(A6) ; also sheet 1
TCU_TX6: A3.D24(A10) ; also sheet 1
TCU_TX7: A3.D29 ; also sheet 1
TELEM_CLK: A3.D13((CLK)D13) U32.16(CLK)
TELEM_SDI: A3.D12((SDI)D12) U32.15(SDO)
TELEM_SDO: A3.D11((SDO)D11) U32.14(SDI)
VBAT: A3.VBAT XA1.VBAT XB1.1(PLUS)
XBDI: A3.D8 A4.3(DIN)
XBDO: A3.D7 A4.2(DOUT)
Unconnected: A3.D2 A3.D3 A3.D4 A3.D5 A3.D6 A3.D9 A3.D10((CS)D10) A3.D18(A4) A3.D19(A5) A3.D26(A12) A3.D27(A13) A3.D32 A3.D34 A3.D35 A3.D36 A3.D37 A3.D38(A14) A3.D39(A15) A3.D40(A16) A4.4(DIO12) A4.5(!RESET) A4.7(PWM1) A4.9(!DTR!/DI08) A4.11(AD4/DIO4) A4.12(!CTS!/DIO7) A4.13(ON/SLEEP/DIO9) A4.16(!RTS!/AD6/DIO6) A4.17(AD3/DIO3) A4.18(AD2/DIO2) A4.19(AD1/DIO1) U32.7(IN3) U32.8(IN4) U32.9(IN5) U32.10(IN6) U32.11(IN7) U33.8(S) U45.8(S) U46.8(S) XA1.PPS

### Notes on the sheet
- decoupling
- Data Acq
- MQTT_CONN
- RSSI
- ASSOC
- Serial3
- Serial2

## Power pins joined to a net without a drawn wire
3.3V: A2.3V3(3.3V) A2.3V3@2(3.3V) A2.3V3@3(3.3V) A3.3V3(3.3V) A3.3V3@2(3.3V) A3.3V3@3(3.3V)
3V3: XA1.3.3V(3V3)
VBAT: A2.VBAT

## Library data of the parts
3V3 5V0 D23 E F SWOK WDOG = HyTechDevices:LED_?_*: LED 0603 Blue <https://www.mouser.com/datasheet/2/216/APT1608VBC_D-246010.pdf> Green <https://www.mouser.com/datasheet/2/216/APT1608ZGCK-1173388.pdf> Orange <https://www.mouser.com/datasheet/2/216/APT1608SECK-6197.pdf> Red <https://www.mouser.com/datasheet/2/216/APT1608SECK-J3-PRV-1173336.pdf> White <https://www.mouser.com/datasheet/2/50/SM0603UWC-880813.pdf> Yellow <https://www.mouser.com/datasheet/2/216/APT1608SYCK-J3-PRV-1173311.pdf> 2835 (Series not on Digikey) Lumiled LUXEON 2835 Color Line <https://www.mouser.com/datasheet/2/602/DS236_luxeon_2835_color_line_datasheet-1596094.pdf>; COLOR: Red; DKPN: 754-1786-1-ND; MANUFACTURER: Kingbright; MOPN: 604-APT1608SECKJ3PRV; MPN: APT1608SECK/J3-PRV
A = HyTechDevices:LED_?_*: LED 0603 Blue <https://www.mouser.com/datasheet/2/216/APT1608VBC_D-246010.pdf> Green <https://www.mouser.com/datasheet/2/216/APT1608ZGCK-1173388.pdf> Orange <https://www.mouser.com/datasheet/2/216/APT1608SECK-6197.pdf> Red <https://www.mouser.com/datasheet/2/216/APT1608SECK-J3-PRV-1173336.pdf> White <https://www.mouser.com/datasheet/2/50/SM0603UWC-880813.pdf> Yellow <https://www.mouser.com/datasheet/2/216/APT1608SYCK-J3-PRV-1173311.pdf> 2835 (Series not on Digikey) Lumiled LUXEON 2835 Color Line <https://www.mouser.com/datasheet/2/602/DS236_luxeon_2835_color_line_datasheet-1596094.pdf>; COLOR: Blue; DKPN: 754-1789-1-ND; MANUFACTURER: Kingbright; MOPN: 604-APT1608VBC/D; MPN: APT1608VBC/D
A1 = HyTechDevices:VOLTAGE_REGULATOR_MODULE_?_*: Voltage Regulator Modules OKI-78SR Datasheet <https://www.mouser.com/datasheet/2/281/oki-78sr-56393.pdf>; DKPN: 811-2196-5-ND; MANUFACTURER: Murata Power Solutions Inc.; MOPN: 580-OKI78SR5/1.5W36C; MPN: OKI-78SR-5/1.5-W36-C
A2 A3 = HyTechDevices:TEENSY_4.1: Teensy 4.1 with VBAT Datasheet <https://www.pjrc.com/store/teensy41.html#pins> Requires ordering of: 2: 24 pin, 0.1" pitch female headers 1: 2 pin, 0.1" pitch female headers; TEENSY: 4.1
A4 = HyTechDevices:XB3-*: XB3 Bluetooth/Cellular Modem Datasheet <https://www.digi.com/resources/documentation/digidocs/pdfs/90001543.pdf>; DKPN: 602-2169-ND; MANUFACTURER: Digi; MOPN: 888-XB3-C-A2-UT-001; MPN: XB3-C-A2-UT-001
B IMD = HyTechDevices:LED_?_*: LED 0603 Blue <https://www.mouser.com/datasheet/2/216/APT1608VBC_D-246010.pdf> Green <https://www.mouser.com/datasheet/2/216/APT1608ZGCK-1173388.pdf> Orange <https://www.mouser.com/datasheet/2/216/APT1608SECK-6197.pdf> Red <https://www.mouser.com/datasheet/2/216/APT1608SECK-J3-PRV-1173336.pdf> White <https://www.mouser.com/datasheet/2/50/SM0603UWC-880813.pdf> Yellow <https://www.mouser.com/datasheet/2/216/APT1608SYCK-J3-PRV-1173311.pdf> 2835 (Series not on Digikey) Lumiled LUXEON 2835 Color Line <https://www.mouser.com/datasheet/2/602/DS236_luxeon_2835_color_line_datasheet-1596094.pdf>; COLOR: Green; DKPN: 754-1790-1-ND; MANUFACTURER: Kingbright; MOPN: 604-APT1608ZGCK; MPN: APT1608ZGCK
BMS BRAKE C D21 = HyTechDevices:LED_?_*: LED 0603 Blue <https://www.mouser.com/datasheet/2/216/APT1608VBC_D-246010.pdf> Green <https://www.mouser.com/datasheet/2/216/APT1608ZGCK-1173388.pdf> Orange <https://www.mouser.com/datasheet/2/216/APT1608SECK-6197.pdf> Red <https://www.mouser.com/datasheet/2/216/APT1608SECK-J3-PRV-1173336.pdf> White <https://www.mouser.com/datasheet/2/50/SM0603UWC-880813.pdf> Yellow <https://www.mouser.com/datasheet/2/216/APT1608SYCK-J3-PRV-1173311.pdf> 2835 (Series not on Digikey) Lumiled LUXEON 2835 Color Line <https://www.mouser.com/datasheet/2/602/DS236_luxeon_2835_color_line_datasheet-1596094.pdf>; COLOR: Yellow; DKPN: 754-1788-1-ND; MANUFACTURER: Kingbright; MOPN: 604-APT1608SYCK/J3-PRV; MPN: APT1608SYCK/J3-PRV
BSPD D D22 = HyTechDevices:LED_?_*: LED 0603 Blue <https://www.mouser.com/datasheet/2/216/APT1608VBC_D-246010.pdf> Green <https://www.mouser.com/datasheet/2/216/APT1608ZGCK-1173388.pdf> Orange <https://www.mouser.com/datasheet/2/216/APT1608SECK-6197.pdf> Red <https://www.mouser.com/datasheet/2/216/APT1608SECK-J3-PRV-1173336.pdf> White <https://www.mouser.com/datasheet/2/50/SM0603UWC-880813.pdf> Yellow <https://www.mouser.com/datasheet/2/216/APT1608SYCK-J3-PRV-1173311.pdf> 2835 (Series not on Digikey) Lumiled LUXEON 2835 Color Line <https://www.mouser.com/datasheet/2/602/DS236_luxeon_2835_color_line_datasheet-1596094.pdf>; COLOR: Orange; DKPN: 754-1120-1-ND; MANUFACTURER: Kingbright; MOPN: 604-APT1608SECK; MPN: APT1608SECK
C1 = HyTechDevices:CAPACITOR_?_*: Capacitor, Non-Polarized VJ...1BC Series Datasheet <https://www.mouser.com/datasheet/2/427/vjw1bcbascomseries-1762447.pdf> Samsung Datasheet <https://www.mouser.com/datasheet/2/585/MLCC-1837944.pdf> Walsin Datasheet <https://www.mouser.com/datasheet/2/210/WTC_MLCC_General_Purpose-1534899.pdf> GRM188R61A226ME15D <https://www.mouser.com/datasheet/2/281/1/GRM188R61A226ME15_02A-1985787.pdf> GRM188R61E106MA73D <https://www.mouser.com/datasheet/2/281/1/GRM188R61E106MA73_01A-1985806.pdf> 885012006013 <https://www.mouser.com/datasheet/2/445/885012006013-1726946.pdf> 2220Y6300105KXTWS2 <https://www.mouser.com/datasheet/2/218/SMD_High_and_Std_StackiCap_P62-1825512.pdf> Yageo Class 2, X5R <https://www.mouser.com/datasheet/2/447/UPY_GPHC_X5R_4V_to_50V_26-1827097.pdf> TDK C Series <https://www.mouser.com/ProductDetail/TDK/C3216X5R1V226M160AC?qs=%2Fha2pyFadujbcx9jh7lYl%2F4NeMoXFhdc8AqVWNq4wW6M2y7zl6GzBuhgtI0ngznN> AVX Automotive MLCC <https://www.mouser.com/datasheet/2/40/AutoMLCC-777028.pdf> KEMET X7R Series <https://www.mouser.com/datasheet/2/212/KEM_C1002_X7R_SMD-1102033.pdf> Kyocera AVX <https://www.mouser.com/datasheet/2/40/C0GNP0_Dielectric-951274.pdf> GRM21BR61H <https://www.mouser.com/datasheet/2/281/1/GRM21BR61H106KE43_01A-1986884.pdf>; CAPACITANCE: 10uF; DKPN: 490-18663-2-ND; MANUFACTURER: Murata; MOPN: 81-GRM21BR61H106KE3L; MPN: GRM21BR61H106KE43L; TOLERANCE: 10%; VOLTAGE: 50V
C2-C4 C27 = HyTechDevices:CAPACITOR_?_*: Capacitor, Non-Polarized VJ...1BC Series Datasheet <https://www.mouser.com/datasheet/2/427/vjw1bcbascomseries-1762447.pdf> Samsung Datasheet <https://www.mouser.com/datasheet/2/585/MLCC-1837944.pdf> Walsin Datasheet <https://www.mouser.com/datasheet/2/210/WTC_MLCC_General_Purpose-1534899.pdf> GRM188R61A226ME15D <https://www.mouser.com/datasheet/2/281/1/GRM188R61A226ME15_02A-1985787.pdf> GRM188R61E106MA73D <https://www.mouser.com/datasheet/2/281/1/GRM188R61E106MA73_01A-1985806.pdf> 885012006013 <https://www.mouser.com/datasheet/2/445/885012006013-1726946.pdf> 2220Y6300105KXTWS2 <https://www.mouser.com/datasheet/2/218/SMD_High_and_Std_StackiCap_P62-1825512.pdf> Yageo Class 2, X5R <https://www.mouser.com/datasheet/2/447/UPY_GPHC_X5R_4V_to_50V_26-1827097.pdf> TDK C Series <https://www.mouser.com/ProductDetail/TDK/C3216X5R1V226M160AC?qs=%2Fha2pyFadujbcx9jh7lYl%2F4NeMoXFhdc8AqVWNq4wW6M2y7zl6GzBuhgtI0ngznN> AVX Automotive MLCC <https://www.mouser.com/datasheet/2/40/AutoMLCC-777028.pdf> KEMET X7R Series <https://www.mouser.com/datasheet/2/212/KEM_C1002_X7R_SMD-1102033.pdf> Kyocera AVX <https://www.mouser.com/datasheet/2/40/C0GNP0_Dielectric-951274.pdf> GRM21BR61H <https://www.mouser.com/datasheet/2/281/1/GRM21BR61H106KE43_01A-1986884.pdf>; CAPACITANCE: 10µF; DKPN: 490-7202-1-ND; MANUFACTURER: Murata Electronics; MOPN: 81-GRM188R61E106MA3D; MPN: GRM188R61E106MA73D; TOLERANCE: 20%; VOLTAGE: 25V
C5-C7 = HyTechDevices:CAPACITOR_?_*: Capacitor, Non-Polarized VJ...1BC Series Datasheet <https://www.mouser.com/datasheet/2/427/vjw1bcbascomseries-1762447.pdf> Samsung Datasheet <https://www.mouser.com/datasheet/2/585/MLCC-1837944.pdf> Walsin Datasheet <https://www.mouser.com/datasheet/2/210/WTC_MLCC_General_Purpose-1534899.pdf> GRM188R61A226ME15D <https://www.mouser.com/datasheet/2/281/1/GRM188R61A226ME15_02A-1985787.pdf> GRM188R61E106MA73D <https://www.mouser.com/datasheet/2/281/1/GRM188R61E106MA73_01A-1985806.pdf> 885012006013 <https://www.mouser.com/datasheet/2/445/885012006013-1726946.pdf> 2220Y6300105KXTWS2 <https://www.mouser.com/datasheet/2/218/SMD_High_and_Std_StackiCap_P62-1825512.pdf> Yageo Class 2, X5R <https://www.mouser.com/datasheet/2/447/UPY_GPHC_X5R_4V_to_50V_26-1827097.pdf> TDK C Series <https://www.mouser.com/ProductDetail/TDK/C3216X5R1V226M160AC?qs=%2Fha2pyFadujbcx9jh7lYl%2F4NeMoXFhdc8AqVWNq4wW6M2y7zl6GzBuhgtI0ngznN> AVX Automotive MLCC <https://www.mouser.com/datasheet/2/40/AutoMLCC-777028.pdf> KEMET X7R Series <https://www.mouser.com/datasheet/2/212/KEM_C1002_X7R_SMD-1102033.pdf> Kyocera AVX <https://www.mouser.com/datasheet/2/40/C0GNP0_Dielectric-951274.pdf> GRM21BR61H <https://www.mouser.com/datasheet/2/281/1/GRM21BR61H106KE43_01A-1986884.pdf>; CAPACITANCE: 4.7nF; DKPN: 732-7931-1-ND; MANUFACTURER: Würth Elektronik; MOPN: 710-885012206012; MPN: 885012206012; TOLERANCE: 10%; VOLTAGE: 10V
C8 C9 C12-C20 C23 C54 C55 C76 C78 C80 C81 C84 C85 C92 C93 C95 C99-C104 = HyTechDevices:CAPACITOR_?_*: Capacitor, Non-Polarized VJ...1BC Series Datasheet <https://www.mouser.com/datasheet/2/427/vjw1bcbascomseries-1762447.pdf> Samsung Datasheet <https://www.mouser.com/datasheet/2/585/MLCC-1837944.pdf> Walsin Datasheet <https://www.mouser.com/datasheet/2/210/WTC_MLCC_General_Purpose-1534899.pdf> GRM188R61A226ME15D <https://www.mouser.com/datasheet/2/281/1/GRM188R61A226ME15_02A-1985787.pdf> GRM188R61E106MA73D <https://www.mouser.com/datasheet/2/281/1/GRM188R61E106MA73_01A-1985806.pdf> 885012006013 <https://www.mouser.com/datasheet/2/445/885012006013-1726946.pdf> 2220Y6300105KXTWS2 <https://www.mouser.com/datasheet/2/218/SMD_High_and_Std_StackiCap_P62-1825512.pdf> Yageo Class 2, X5R <https://www.mouser.com/datasheet/2/447/UPY_GPHC_X5R_4V_to_50V_26-1827097.pdf> TDK C Series <https://www.mouser.com/ProductDetail/TDK/C3216X5R1V226M160AC?qs=%2Fha2pyFadujbcx9jh7lYl%2F4NeMoXFhdc8AqVWNq4wW6M2y7zl6GzBuhgtI0ngznN> AVX Automotive MLCC <https://www.mouser.com/datasheet/2/40/AutoMLCC-777028.pdf> KEMET X7R Series <https://www.mouser.com/datasheet/2/212/KEM_C1002_X7R_SMD-1102033.pdf> Kyocera AVX <https://www.mouser.com/datasheet/2/40/C0GNP0_Dielectric-951274.pdf> GRM21BR61H <https://www.mouser.com/datasheet/2/281/1/GRM21BR61H106KE43_01A-1986884.pdf>; CAPACITANCE: 0.1µF; DKPN: 720-1688-1-ND; MANUFACTURER: Vishay Vitramon; MOPN: 77-VJ0603Y104JXQPBC; MPN: VJ0603Y104JXQPW1BC; TOLERANCE: 5%; VOLTAGE: 10V
C10 C11 C21 C22 C24 C25 C56 C57 C77 C79 C82 C83 = HyTechDevices:CAPACITOR_?_*: Capacitor, Non-Polarized VJ...1BC Series Datasheet <https://www.mouser.com/datasheet/2/427/vjw1bcbascomseries-1762447.pdf> Samsung Datasheet <https://www.mouser.com/datasheet/2/585/MLCC-1837944.pdf> Walsin Datasheet <https://www.mouser.com/datasheet/2/210/WTC_MLCC_General_Purpose-1534899.pdf> GRM188R61A226ME15D <https://www.mouser.com/datasheet/2/281/1/GRM188R61A226ME15_02A-1985787.pdf> GRM188R61E106MA73D <https://www.mouser.com/datasheet/2/281/1/GRM188R61E106MA73_01A-1985806.pdf> 885012006013 <https://www.mouser.com/datasheet/2/445/885012006013-1726946.pdf> 2220Y6300105KXTWS2 <https://www.mouser.com/datasheet/2/218/SMD_High_and_Std_StackiCap_P62-1825512.pdf> Yageo Class 2, X5R <https://www.mouser.com/datasheet/2/447/UPY_GPHC_X5R_4V_to_50V_26-1827097.pdf> TDK C Series <https://www.mouser.com/ProductDetail/TDK/C3216X5R1V226M160AC?qs=%2Fha2pyFadujbcx9jh7lYl%2F4NeMoXFhdc8AqVWNq4wW6M2y7zl6GzBuhgtI0ngznN> AVX Automotive MLCC <https://www.mouser.com/datasheet/2/40/AutoMLCC-777028.pdf> KEMET X7R Series <https://www.mouser.com/datasheet/2/212/KEM_C1002_X7R_SMD-1102033.pdf> Kyocera AVX <https://www.mouser.com/datasheet/2/40/C0GNP0_Dielectric-951274.pdf> GRM21BR61H <https://www.mouser.com/datasheet/2/281/1/GRM21BR61H106KE43_01A-1986884.pdf>; CAPACITANCE: 1µF; DKPN: 311-1796-1-ND; MANUFACTURER: Yageo; MOPN: 603-CC603KRX7R6BB105; MPN: CC0603KRX7R6BB105; TOLERANCE: 10%; VOLTAGE: 10V
C26 = HyTechDevices:EEH-AZS*: EEH_AZS Hybrid Electrolytic Capacitor Datasheet <https://www.mouser.com/datasheet/2/315/DMD0000COL92-1141863.pdf>; CAPACITANCE: 470µF; DKPN: 10-EEH-AZS1V471BCT-ND; MANUFACTURER: Panasonic Electronic Components; MOPN: 667-EEH-AZS1V471B; MPN: EEH-AZS1V471B; TOLERANCE: 20%; VOLTAGE: 35V
C28 = HyTechDevices:CAPACITOR_?_*: Capacitor, Non-Polarized VJ...1BC Series Datasheet <https://www.mouser.com/datasheet/2/427/vjw1bcbascomseries-1762447.pdf> Samsung Datasheet <https://www.mouser.com/datasheet/2/585/MLCC-1837944.pdf> Walsin Datasheet <https://www.mouser.com/datasheet/2/210/WTC_MLCC_General_Purpose-1534899.pdf> GRM188R61A226ME15D <https://www.mouser.com/datasheet/2/281/1/GRM188R61A226ME15_02A-1985787.pdf> GRM188R61E106MA73D <https://www.mouser.com/datasheet/2/281/1/GRM188R61E106MA73_01A-1985806.pdf> 885012006013 <https://www.mouser.com/datasheet/2/445/885012006013-1726946.pdf> 2220Y6300105KXTWS2 <https://www.mouser.com/datasheet/2/218/SMD_High_and_Std_StackiCap_P62-1825512.pdf> Yageo Class 2, X5R <https://www.mouser.com/datasheet/2/447/UPY_GPHC_X5R_4V_to_50V_26-1827097.pdf> TDK C Series <https://www.mouser.com/ProductDetail/TDK/C3216X5R1V226M160AC?qs=%2Fha2pyFadujbcx9jh7lYl%2F4NeMoXFhdc8AqVWNq4wW6M2y7zl6GzBuhgtI0ngznN> AVX Automotive MLCC <https://www.mouser.com/datasheet/2/40/AutoMLCC-777028.pdf> KEMET X7R Series <https://www.mouser.com/datasheet/2/212/KEM_C1002_X7R_SMD-1102033.pdf> Kyocera AVX <https://www.mouser.com/datasheet/2/40/C0GNP0_Dielectric-951274.pdf> GRM21BR61H <https://www.mouser.com/datasheet/2/281/1/GRM21BR61H106KE43_01A-1986884.pdf>; CAPACITANCE: 1µF; DKPN: 1276-1184-1-ND; MANUFACTURER: Samsung Electro-Mechanics; MOPN: 187-CL10B105KA8NNNC; MPN: CL10B105KA8NNNC; TOLERANCE: 10%; VOLTAGE: 25V
C29 = HyTechDevices:CAPACITOR_?_*: Capacitor, Non-Polarized VJ...1BC Series Datasheet <https://www.mouser.com/datasheet/2/427/vjw1bcbascomseries-1762447.pdf> Samsung Datasheet <https://www.mouser.com/datasheet/2/585/MLCC-1837944.pdf> Walsin Datasheet <https://www.mouser.com/datasheet/2/210/WTC_MLCC_General_Purpose-1534899.pdf> GRM188R61A226ME15D <https://www.mouser.com/datasheet/2/281/1/GRM188R61A226ME15_02A-1985787.pdf> GRM188R61E106MA73D <https://www.mouser.com/datasheet/2/281/1/GRM188R61E106MA73_01A-1985806.pdf> 885012006013 <https://www.mouser.com/datasheet/2/445/885012006013-1726946.pdf> 2220Y6300105KXTWS2 <https://www.mouser.com/datasheet/2/218/SMD_High_and_Std_StackiCap_P62-1825512.pdf> Yageo Class 2, X5R <https://www.mouser.com/datasheet/2/447/UPY_GPHC_X5R_4V_to_50V_26-1827097.pdf> TDK C Series <https://www.mouser.com/ProductDetail/TDK/C3216X5R1V226M160AC?qs=%2Fha2pyFadujbcx9jh7lYl%2F4NeMoXFhdc8AqVWNq4wW6M2y7zl6GzBuhgtI0ngznN> AVX Automotive MLCC <https://www.mouser.com/datasheet/2/40/AutoMLCC-777028.pdf> KEMET X7R Series <https://www.mouser.com/datasheet/2/212/KEM_C1002_X7R_SMD-1102033.pdf> Kyocera AVX <https://www.mouser.com/datasheet/2/40/C0GNP0_Dielectric-951274.pdf> GRM21BR61H <https://www.mouser.com/datasheet/2/281/1/GRM21BR61H106KE43_01A-1986884.pdf>; CAPACITANCE: 0.1µF; DKPN: 1276-1006-1-ND; MANUFACTURER: Samsung Electro-Mechanics; MOPN: 187-CL10B104KA8NNNC; MPN: CL10B104KA8NNNC; TOLERANCE: 10%; VOLTAGE: 25V
D1-D3 = HyTechDevices:TVS_BIDIRECTIONAL_DUAL: Bdirectional TVS for CAN ESD Datasheet <https://www.ti.com/lit/ds/symlink/tpd2e007.pdf?HQS=dis-mous-null-mousermode-dsf-pf-null-wwe&ts=1615155679700&ref_url=https%253A%252F%252Fwww.mouser.com%252F>; DKPN: 296-25281-1-ND; MANUFACTURER: Texas Instruments; MOPN: 595-TPD2E007DCKR; MPN: TPD2E007DCKR
D4-D7 D24 D25 D29-D35 D40-D46 = HyTechDevices:SCHOTTKY_?_*: CUS08F30 Shottky Diode Datasheet <https://www.mouser.com/datasheet/2/408/CUS08F30_datasheet_en_20140414-1916097.pdf>; CURRENT: 0.8A; DKPN: CUS08F30H3FTR-ND; MANUFACTURER: Toshiba Semiconductor and Storage; MOPN: 757-CUS08F30H3F; MPN: CUS08F30; VOLTAGE: 30V
D28 = HyTechDevices:TVS_*: TVS Diode GSOT Datasheet <https://www.mouser.com/datasheet/2/427/gsot03-1767593.pdf>; DKPN: GSOT05-E3-08TR-ND; MANUFACTURER: Vishay General Semiconductor - Diodes Division; MOPN: 78-GSOT05-E3-08; MPN: GSOT05-E3-08; VOLTAGE: 5V
D36-D39 = HyTechDevices:TVS_*: TVS Diode GSOT Datasheet <https://www.mouser.com/datasheet/2/427/gsot03-1767593.pdf>; DKPN: GSOT15-E3-08CT-ND; MANUFACTURER: Vishay General Semiconductor - Diodes Division; MOPN: 78-GSOT15-E3-08; MPN: GSOT15-E3-08; VOLTAGE: 15V
J1 J3-J5 = HyTechDevices:CONNECTOR-40_?_*: 40 pin ribbon connector header (EHT-120-01) Catalog <https://suddendocs.samtec.com/catalog_english/eht.pdf> Datasheet <http://suddendocs.samtec.com/prints/eht-d.pdf> Part <https://www.digikey.com/en/products/detail/samtec-inc/EHT-120-01-S-D/1106698>; DKPN: SAM8560-ND; MANUFACTURER: Samtec; MOPN: 200-EHT12001SD; MPN: EHT-120-01-S-D
J2 = HyTechDevices:ADIS16460*: 14 pin connector specifically for ADIS16460 IMU Samtec Tiger Claw Datasheet <https://suddendocs.samtec.com/catalog_english/clm_sm.pdf>; DKPN: SAM1129-07-ND; MANUFACTURER: Samtec Inc.; MPN: CLM-107-02
JP1-JP3 = HyTechDevices:JUMPER_?_*: 2 Pin Connector; DKPN: S1011EC-02-ND; MANUFACTURER: Sullins Connector Solutions; MPN: PRPC002SAAN-RC
K1 K9-K12 = HyTechDevices:RELAY_DPDT_*: Dual Pole, Dual Throw Relay Datasheet <https://www.mouser.com/datasheet/2/418/5/NG_DS_RT2_1014-572844.pdf>; DKPN: PB969-ND; MANUFACTURER: TE Connectivity; MOPN: 655-RT424024; MPN: RT424024
LATCH = HyTechDevices:LED_?_*: LED 0603 Blue <https://www.mouser.com/datasheet/2/216/APT1608VBC_D-246010.pdf> Green <https://www.mouser.com/datasheet/2/216/APT1608ZGCK-1173388.pdf> Orange <https://www.mouser.com/datasheet/2/216/APT1608SECK-6197.pdf> Red <https://www.mouser.com/datasheet/2/216/APT1608SECK-J3-PRV-1173336.pdf> White <https://www.mouser.com/datasheet/2/50/SM0603UWC-880813.pdf> Yellow <https://www.mouser.com/datasheet/2/216/APT1608SYCK-J3-PRV-1173311.pdf> 2835 (Series not on Digikey) Lumiled LUXEON 2835 Color Line <https://www.mouser.com/datasheet/2/602/DS236_luxeon_2835_color_line_datasheet-1596094.pdf>; COLOR: White; DKPN: SM0603UWC-ND; MANUFACTURER: Bivar Inc.; MOPN: 749-SM0603UWC; MPN: SM0603UWC
Q3 Q5 = HyTechDevices:TRANSISTOR_P_MOS_?_*: P-MOSFET SI2369DS Datasheet <https://www.mouser.com/datasheet/2/427/si2369d-1764360.pdf> DMP3056L Datasheet <https://www.mouser.com/datasheet/2/115/DIOD_S_A0012915142_1-2543925.pdf>; DKPN: DMP3056L-7DITR-ND; MANUFACTURER: Diodes Incorporated; MOPN: 621-DMP3056L-7; MPN: DMP3056L-7
Q4 Q6 = HyTechDevices:TRANSISTOR_N_MOS_?_*: N-MOSFET PMV15ENEA Datasheet <https://www.mouser.com/datasheet/2/916/PMV15ENEA-1604828.pdf> TK6P65W Datasheet <https://www.mouser.com/datasheet/2/408/TK6P65W_datasheet_en_20151225-1916290.pdf> SIR638ADP Datasheet <https://www.mouser.com/datasheet/2/427/sir638adp-1766131.pdf> DMG3406L Datasheet <https://www.diodes.com/assets/Datasheets/DMG3406L.pdf>; DKPN: DMG3406L-7DITR-ND; MANUFACTURER: Diodes Incorporated; MOPN: 621-DMG3406L-7; MPN: DMG3406L-7
R1-R6 R35-R37 = HyTechDevices:RESISTOR_?_*: Resistor PWR163 Series <https://www.mouser.com/datasheet/2/54/pwr163-777985.pdf> AC Series <https://www.mouser.com/datasheet/2/447/Yageo_PYu_AC_51_RoHS_L_7_1714230-1874691.pdf> PU Series <https://www.mouser.com/datasheet/2/447/PYu-PU_51_RoHS_L_6-1504619.pdf> ERA Series <https://www.mouser.com/datasheet/2/315/AOA0000C307-1149632.pdf> PWR263 Series <https://www.mouser.com/datasheet/2/54/pwr263s_35-778069.pdf> KTR Series <https://www.mouser.com/datasheet/2/348/ROHM_S_A0011075115_1-2563276.pdf> RC Series <https://www.mouser.com/datasheet/2/447/Yageo_03_18_2021_PYu_RC_Group_51_RoHS_L_11-2199992.pdf> ERJ PB3, PB6 Series <https://www.mouser.com/datasheet/2/315/AOA0000C328-1530132.pdf> ERJ PA2, P03, PA3, P06, P08, P14 Series <https://www.mouser.com/datasheet/2/315/AOA0000C331-1141874.pdf> B20 Series <https://www.ohmite.com/assets/docs/res_200.pdf?r=false> TE Connectivity/Holsworthy RN73 Series <https://www.mouser.com/datasheet/2/418/4/NG_DS_1773270_M-604713.pdf> Vishay Dale D/CRCW e3 <https://www.mouser.com/datasheet/2/427/dcrcwe3-1762152.pdf> Ohmite B20 <https://www.ohmite.com/assets/docs/res_200.pdf?r=false>; DKPN: 311-60.4HRCT-ND; MANUFACTURER: Yageo; MOPN: 603-RC0603FR-0760R4L; MPN: RC0603FR-0760R4L; POWER: 0.1W; RESISTANCE: 60.4; TOLERANCE: 1%; VOLTAGE_CONTINUOUS: 2.48V; VOLTAGE_MAX: 75V
R7 R10 R14 R15 R17 R19 R21 R33 R42 R44 R46 R48 R50 R52 R60 R61 R65 = HyTechDevices:RESISTOR_?_*: Resistor PWR163 Series <https://www.mouser.com/datasheet/2/54/pwr163-777985.pdf> AC Series <https://www.mouser.com/datasheet/2/447/Yageo_PYu_AC_51_RoHS_L_7_1714230-1874691.pdf> PU Series <https://www.mouser.com/datasheet/2/447/PYu-PU_51_RoHS_L_6-1504619.pdf> ERA Series <https://www.mouser.com/datasheet/2/315/AOA0000C307-1149632.pdf> PWR263 Series <https://www.mouser.com/datasheet/2/54/pwr263s_35-778069.pdf> KTR Series <https://www.mouser.com/datasheet/2/348/ROHM_S_A0011075115_1-2563276.pdf> RC Series <https://www.mouser.com/datasheet/2/447/Yageo_03_18_2021_PYu_RC_Group_51_RoHS_L_11-2199992.pdf> ERJ PB3, PB6 Series <https://www.mouser.com/datasheet/2/315/AOA0000C328-1530132.pdf> ERJ PA2, P03, PA3, P06, P08, P14 Series <https://www.mouser.com/datasheet/2/315/AOA0000C331-1141874.pdf> B20 Series <https://www.ohmite.com/assets/docs/res_200.pdf?r=false> TE Connectivity/Holsworthy RN73 Series <https://www.mouser.com/datasheet/2/418/4/NG_DS_1773270_M-604713.pdf> Vishay Dale D/CRCW e3 <https://www.mouser.com/datasheet/2/427/dcrcwe3-1762152.pdf> Ohmite B20 <https://www.ohmite.com/assets/docs/res_200.pdf?r=false>; DKPN: 311-10.0KHRCT-ND; MANUFACTURER: Yageo; MOPN: 603-RC0603FR-0710KL; MPN: RC0603FR-0710KL; POWER: 0.1W; RESISTANCE: 10k; TOLERANCE: 1%; VOLTAGE_CONTINUOUS: 31.62V; VOLTAGE_MAX: 75V
R8 R9 R64 R66 = HyTechDevices:RESISTOR_?_*: Resistor PWR163 Series <https://www.mouser.com/datasheet/2/54/pwr163-777985.pdf> AC Series <https://www.mouser.com/datasheet/2/447/Yageo_PYu_AC_51_RoHS_L_7_1714230-1874691.pdf> PU Series <https://www.mouser.com/datasheet/2/447/PYu-PU_51_RoHS_L_6-1504619.pdf> ERA Series <https://www.mouser.com/datasheet/2/315/AOA0000C307-1149632.pdf> PWR263 Series <https://www.mouser.com/datasheet/2/54/pwr263s_35-778069.pdf> KTR Series <https://www.mouser.com/datasheet/2/348/ROHM_S_A0011075115_1-2563276.pdf> RC Series <https://www.mouser.com/datasheet/2/447/Yageo_03_18_2021_PYu_RC_Group_51_RoHS_L_11-2199992.pdf> ERJ PB3, PB6 Series <https://www.mouser.com/datasheet/2/315/AOA0000C328-1530132.pdf> ERJ PA2, P03, PA3, P06, P08, P14 Series <https://www.mouser.com/datasheet/2/315/AOA0000C331-1141874.pdf> B20 Series <https://www.ohmite.com/assets/docs/res_200.pdf?r=false> TE Connectivity/Holsworthy RN73 Series <https://www.mouser.com/datasheet/2/418/4/NG_DS_1773270_M-604713.pdf> Vishay Dale D/CRCW e3 <https://www.mouser.com/datasheet/2/427/dcrcwe3-1762152.pdf> Ohmite B20 <https://www.ohmite.com/assets/docs/res_200.pdf?r=false>; DKPN: 311-5.10KHRTR-ND; MANUFACTURER: Yageo; MOPN: 603-RC0603FR-075K1L; MPN: RC0603FR-075K1L; POWER: 0.1W; RESISTANCE: 5.1k; TOLERANCE: 1%; VOLTAGE_CONTINUOUS: 22.58V; VOLTAGE_MAX: 75V
R11 R16 R18 R20 R22 R45 R47 R49 R51 R53 = HyTechDevices:RESISTOR_?_*: Resistor PWR163 Series <https://www.mouser.com/datasheet/2/54/pwr163-777985.pdf> AC Series <https://www.mouser.com/datasheet/2/447/Yageo_PYu_AC_51_RoHS_L_7_1714230-1874691.pdf> PU Series <https://www.mouser.com/datasheet/2/447/PYu-PU_51_RoHS_L_6-1504619.pdf> ERA Series <https://www.mouser.com/datasheet/2/315/AOA0000C307-1149632.pdf> PWR263 Series <https://www.mouser.com/datasheet/2/54/pwr263s_35-778069.pdf> KTR Series <https://www.mouser.com/datasheet/2/348/ROHM_S_A0011075115_1-2563276.pdf> RC Series <https://www.mouser.com/datasheet/2/447/Yageo_03_18_2021_PYu_RC_Group_51_RoHS_L_11-2199992.pdf> ERJ PB3, PB6 Series <https://www.mouser.com/datasheet/2/315/AOA0000C328-1530132.pdf> ERJ PA2, P03, PA3, P06, P08, P14 Series <https://www.mouser.com/datasheet/2/315/AOA0000C331-1141874.pdf> B20 Series <https://www.ohmite.com/assets/docs/res_200.pdf?r=false> TE Connectivity/Holsworthy RN73 Series <https://www.mouser.com/datasheet/2/418/4/NG_DS_1773270_M-604713.pdf> Vishay Dale D/CRCW e3 <https://www.mouser.com/datasheet/2/427/dcrcwe3-1762152.pdf> Ohmite B20 <https://www.ohmite.com/assets/docs/res_200.pdf?r=false>; DKPN: P1.33KDBCT-ND; MANUFACTURER: Panasonic Electronic Components; MOPN: 667-ERA-3AEB1331V; MPN: ERA-3AEB1331V; POWER: 0.1W; RESISTANCE: 1.33k; TOLERANCE: 0.1%; VOLTAGE_CONTINUOUS: 11.53V; VOLTAGE_MAX: 75V
R12 R23 R34 = HyTechDevices:RESISTOR_?_*: Resistor PWR163 Series <https://www.mouser.com/datasheet/2/54/pwr163-777985.pdf> AC Series <https://www.mouser.com/datasheet/2/447/Yageo_PYu_AC_51_RoHS_L_7_1714230-1874691.pdf> PU Series <https://www.mouser.com/datasheet/2/447/PYu-PU_51_RoHS_L_6-1504619.pdf> ERA Series <https://www.mouser.com/datasheet/2/315/AOA0000C307-1149632.pdf> PWR263 Series <https://www.mouser.com/datasheet/2/54/pwr263s_35-778069.pdf> KTR Series <https://www.mouser.com/datasheet/2/348/ROHM_S_A0011075115_1-2563276.pdf> RC Series <https://www.mouser.com/datasheet/2/447/Yageo_03_18_2021_PYu_RC_Group_51_RoHS_L_11-2199992.pdf> ERJ PB3, PB6 Series <https://www.mouser.com/datasheet/2/315/AOA0000C328-1530132.pdf> ERJ PA2, P03, PA3, P06, P08, P14 Series <https://www.mouser.com/datasheet/2/315/AOA0000C331-1141874.pdf> B20 Series <https://www.ohmite.com/assets/docs/res_200.pdf?r=false> TE Connectivity/Holsworthy RN73 Series <https://www.mouser.com/datasheet/2/418/4/NG_DS_1773270_M-604713.pdf> Vishay Dale D/CRCW e3 <https://www.mouser.com/datasheet/2/427/dcrcwe3-1762152.pdf> Ohmite B20 <https://www.ohmite.com/assets/docs/res_200.pdf?r=false>; DKPN: 311-100HRCT-ND; MANUFACTURER: Yageo; MOPN: 603-RC0603FR-07100RL; MPN: RC0603FR-07100RL; POWER: 0.1W; RESISTANCE: 100; TOLERANCE: 1%; VOLTAGE_CONTINUOUS: 3.16V; VOLTAGE_MAX: 75V
R13 = HyTechDevices:RESISTOR_?_*: Resistor PWR163 Series <https://www.mouser.com/datasheet/2/54/pwr163-777985.pdf> AC Series <https://www.mouser.com/datasheet/2/447/Yageo_PYu_AC_51_RoHS_L_7_1714230-1874691.pdf> PU Series <https://www.mouser.com/datasheet/2/447/PYu-PU_51_RoHS_L_6-1504619.pdf> ERA Series <https://www.mouser.com/datasheet/2/315/AOA0000C307-1149632.pdf> PWR263 Series <https://www.mouser.com/datasheet/2/54/pwr263s_35-778069.pdf> KTR Series <https://www.mouser.com/datasheet/2/348/ROHM_S_A0011075115_1-2563276.pdf> RC Series <https://www.mouser.com/datasheet/2/447/Yageo_03_18_2021_PYu_RC_Group_51_RoHS_L_11-2199992.pdf> ERJ PB3, PB6 Series <https://www.mouser.com/datasheet/2/315/AOA0000C328-1530132.pdf> ERJ PA2, P03, PA3, P06, P08, P14 Series <https://www.mouser.com/datasheet/2/315/AOA0000C331-1141874.pdf> B20 Series <https://www.ohmite.com/assets/docs/res_200.pdf?r=false> TE Connectivity/Holsworthy RN73 Series <https://www.mouser.com/datasheet/2/418/4/NG_DS_1773270_M-604713.pdf> Vishay Dale D/CRCW e3 <https://www.mouser.com/datasheet/2/427/dcrcwe3-1762152.pdf> Ohmite B20 <https://www.ohmite.com/assets/docs/res_200.pdf?r=false>; DKPN: 311-240HRCT-ND; MANUFACTURER: Yageo; MOPN: 603-RC0603FR-07240RL; MPN: RC0603FR-07240RL; POWER: 0.1W; RESISTANCE: 240; TOLERANCE: 1%; VOLTAGE_CONTINUOUS: 4.90V; VOLTAGE_MAX: 75V
R24-R32 R38 = HyTechDevices:RESISTOR_?_*: Resistor PWR163 Series <https://www.mouser.com/datasheet/2/54/pwr163-777985.pdf> AC Series <https://www.mouser.com/datasheet/2/447/Yageo_PYu_AC_51_RoHS_L_7_1714230-1874691.pdf> PU Series <https://www.mouser.com/datasheet/2/447/PYu-PU_51_RoHS_L_6-1504619.pdf> ERA Series <https://www.mouser.com/datasheet/2/315/AOA0000C307-1149632.pdf> PWR263 Series <https://www.mouser.com/datasheet/2/54/pwr263s_35-778069.pdf> KTR Series <https://www.mouser.com/datasheet/2/348/ROHM_S_A0011075115_1-2563276.pdf> RC Series <https://www.mouser.com/datasheet/2/447/Yageo_03_18_2021_PYu_RC_Group_51_RoHS_L_11-2199992.pdf> ERJ PB3, PB6 Series <https://www.mouser.com/datasheet/2/315/AOA0000C328-1530132.pdf> ERJ PA2, P03, PA3, P06, P08, P14 Series <https://www.mouser.com/datasheet/2/315/AOA0000C331-1141874.pdf> B20 Series <https://www.ohmite.com/assets/docs/res_200.pdf?r=false> TE Connectivity/Holsworthy RN73 Series <https://www.mouser.com/datasheet/2/418/4/NG_DS_1773270_M-604713.pdf> Vishay Dale D/CRCW e3 <https://www.mouser.com/datasheet/2/427/dcrcwe3-1762152.pdf> Ohmite B20 <https://www.ohmite.com/assets/docs/res_200.pdf?r=false>; DKPN: 10-ERJ-UP3F2001VTR-ND; MANUFACTURER: Panasonic Electronic Components; MOPN: 667-ERJ-UP3F2001V; MPN: ERJ-UP3F2001V; POWER: 0.25W; RESISTANCE: 2k; TOLERANCE: 1%; VOLTAGE_CONTINUOUS: 22.36V; VOLTAGE_MAX: 150V
R40 = HyTechDevices:RESISTOR_?_*: Resistor PWR163 Series <https://www.mouser.com/datasheet/2/54/pwr163-777985.pdf> AC Series <https://www.mouser.com/datasheet/2/447/Yageo_PYu_AC_51_RoHS_L_7_1714230-1874691.pdf> PU Series <https://www.mouser.com/datasheet/2/447/PYu-PU_51_RoHS_L_6-1504619.pdf> ERA Series <https://www.mouser.com/datasheet/2/315/AOA0000C307-1149632.pdf> PWR263 Series <https://www.mouser.com/datasheet/2/54/pwr263s_35-778069.pdf> KTR Series <https://www.mouser.com/datasheet/2/348/ROHM_S_A0011075115_1-2563276.pdf> RC Series <https://www.mouser.com/datasheet/2/447/Yageo_03_18_2021_PYu_RC_Group_51_RoHS_L_11-2199992.pdf> ERJ PB3, PB6 Series <https://www.mouser.com/datasheet/2/315/AOA0000C328-1530132.pdf> ERJ PA2, P03, PA3, P06, P08, P14 Series <https://www.mouser.com/datasheet/2/315/AOA0000C331-1141874.pdf> B20 Series <https://www.ohmite.com/assets/docs/res_200.pdf?r=false> TE Connectivity/Holsworthy RN73 Series <https://www.mouser.com/datasheet/2/418/4/NG_DS_1773270_M-604713.pdf> Vishay Dale D/CRCW e3 <https://www.mouser.com/datasheet/2/427/dcrcwe3-1762152.pdf> Ohmite B20 <https://www.ohmite.com/assets/docs/res_200.pdf?r=false>; DKPN: 311-180HRCT-ND; MANUFACTURER: Yageo; MOPN: 603-RC0603FR-07180RL; MPN: RC0603FR-07180RL; POWER: 0.1W; RESISTANCE: 180; TOLERANCE: 1%; VOLTAGE_CONTINUOUS: 4.24V; VOLTAGE_MAX: 75V
R43 = HyTechDevices:RESISTOR_?_*: Resistor PWR163 Series <https://www.mouser.com/datasheet/2/54/pwr163-777985.pdf> AC Series <https://www.mouser.com/datasheet/2/447/Yageo_PYu_AC_51_RoHS_L_7_1714230-1874691.pdf> PU Series <https://www.mouser.com/datasheet/2/447/PYu-PU_51_RoHS_L_6-1504619.pdf> ERA Series <https://www.mouser.com/datasheet/2/315/AOA0000C307-1149632.pdf> PWR263 Series <https://www.mouser.com/datasheet/2/54/pwr263s_35-778069.pdf> KTR Series <https://www.mouser.com/datasheet/2/348/ROHM_S_A0011075115_1-2563276.pdf> RC Series <https://www.mouser.com/datasheet/2/447/Yageo_03_18_2021_PYu_RC_Group_51_RoHS_L_11-2199992.pdf> ERJ PB3, PB6 Series <https://www.mouser.com/datasheet/2/315/AOA0000C328-1530132.pdf> ERJ PA2, P03, PA3, P06, P08, P14 Series <https://www.mouser.com/datasheet/2/315/AOA0000C331-1141874.pdf> B20 Series <https://www.ohmite.com/assets/docs/res_200.pdf?r=false> TE Connectivity/Holsworthy RN73 Series <https://www.mouser.com/datasheet/2/418/4/NG_DS_1773270_M-604713.pdf> Vishay Dale D/CRCW e3 <https://www.mouser.com/datasheet/2/427/dcrcwe3-1762152.pdf> Ohmite B20 <https://www.ohmite.com/assets/docs/res_200.pdf?r=false>; DKPN: 311-2.55KHRCT-ND; MANUFACTURER: Yageo; MOPN: 603-RC0603FR-072K55L; MPN: RC0603FR-072K55L; POWER: 0.1W; RESISTANCE: 2.55k; TOLERANCE: 1%; VOLTAGE_CONTINUOUS: 15.97V; VOLTAGE_MAX: 75V
R58 = HyTechDevices:RESISTOR_?_*: Resistor PWR163 Series <https://www.mouser.com/datasheet/2/54/pwr163-777985.pdf> AC Series <https://www.mouser.com/datasheet/2/447/Yageo_PYu_AC_51_RoHS_L_7_1714230-1874691.pdf> PU Series <https://www.mouser.com/datasheet/2/447/PYu-PU_51_RoHS_L_6-1504619.pdf> ERA Series <https://www.mouser.com/datasheet/2/315/AOA0000C307-1149632.pdf> PWR263 Series <https://www.mouser.com/datasheet/2/54/pwr263s_35-778069.pdf> KTR Series <https://www.mouser.com/datasheet/2/348/ROHM_S_A0011075115_1-2563276.pdf> RC Series <https://www.mouser.com/datasheet/2/447/Yageo_03_18_2021_PYu_RC_Group_51_RoHS_L_11-2199992.pdf> ERJ PB3, PB6 Series <https://www.mouser.com/datasheet/2/315/AOA0000C328-1530132.pdf> ERJ PA2, P03, PA3, P06, P08, P14 Series <https://www.mouser.com/datasheet/2/315/AOA0000C331-1141874.pdf> B20 Series <https://www.ohmite.com/assets/docs/res_200.pdf?r=false> TE Connectivity/Holsworthy RN73 Series <https://www.mouser.com/datasheet/2/418/4/NG_DS_1773270_M-604713.pdf> Vishay Dale D/CRCW e3 <https://www.mouser.com/datasheet/2/427/dcrcwe3-1762152.pdf> Ohmite B20 <https://www.ohmite.com/assets/docs/res_200.pdf?r=false>; DKPN: 1712-CPF-A-0603B1K0ETR-ND; MANUFACTURER: TE Connectivity Passive Product; MOPN: 279-CPF-A-0603B1K0E; MPN: CPF-A-0603B1K0E; POWER: 0.0625W; RESISTANCE: 1k; TOLERANCE: 0.1%; VOLTAGE_CONTINUOUS: 7.9V; VOLTAGE_MAX: 50V
R59 = HyTechDevices:RESISTOR_?_*: Resistor PWR163 Series <https://www.mouser.com/datasheet/2/54/pwr163-777985.pdf> AC Series <https://www.mouser.com/datasheet/2/447/Yageo_PYu_AC_51_RoHS_L_7_1714230-1874691.pdf> PU Series <https://www.mouser.com/datasheet/2/447/PYu-PU_51_RoHS_L_6-1504619.pdf> ERA Series <https://www.mouser.com/datasheet/2/315/AOA0000C307-1149632.pdf> PWR263 Series <https://www.mouser.com/datasheet/2/54/pwr263s_35-778069.pdf> KTR Series <https://www.mouser.com/datasheet/2/348/ROHM_S_A0011075115_1-2563276.pdf> RC Series <https://www.mouser.com/datasheet/2/447/Yageo_03_18_2021_PYu_RC_Group_51_RoHS_L_11-2199992.pdf> ERJ PB3, PB6 Series <https://www.mouser.com/datasheet/2/315/AOA0000C328-1530132.pdf> ERJ PA2, P03, PA3, P06, P08, P14 Series <https://www.mouser.com/datasheet/2/315/AOA0000C331-1141874.pdf> B20 Series <https://www.ohmite.com/assets/docs/res_200.pdf?r=false> TE Connectivity/Holsworthy RN73 Series <https://www.mouser.com/datasheet/2/418/4/NG_DS_1773270_M-604713.pdf> Vishay Dale D/CRCW e3 <https://www.mouser.com/datasheet/2/427/dcrcwe3-1762152.pdf> Ohmite B20 <https://www.ohmite.com/assets/docs/res_200.pdf?r=false>; DKPN: P20155CT-ND; MANUFACTURER: Panasonic Electronic Components; MOPN: 667-ERJ-PB3B4122V; MPN: ERJ-PB3B4122V; POWER: 0.2W; RESISTANCE: 41.2k; TOLERANCE: 0.1%; VOLTAGE_CONTINUOUS: 150V; VOLTAGE_MAX: 200V
R62 R68 = HyTechDevices:RESISTOR_?_*: Resistor PWR163 Series <https://www.mouser.com/datasheet/2/54/pwr163-777985.pdf> AC Series <https://www.mouser.com/datasheet/2/447/Yageo_PYu_AC_51_RoHS_L_7_1714230-1874691.pdf> PU Series <https://www.mouser.com/datasheet/2/447/PYu-PU_51_RoHS_L_6-1504619.pdf> ERA Series <https://www.mouser.com/datasheet/2/315/AOA0000C307-1149632.pdf> PWR263 Series <https://www.mouser.com/datasheet/2/54/pwr263s_35-778069.pdf> KTR Series <https://www.mouser.com/datasheet/2/348/ROHM_S_A0011075115_1-2563276.pdf> RC Series <https://www.mouser.com/datasheet/2/447/Yageo_03_18_2021_PYu_RC_Group_51_RoHS_L_11-2199992.pdf> ERJ PB3, PB6 Series <https://www.mouser.com/datasheet/2/315/AOA0000C328-1530132.pdf> ERJ PA2, P03, PA3, P06, P08, P14 Series <https://www.mouser.com/datasheet/2/315/AOA0000C331-1141874.pdf> B20 Series <https://www.ohmite.com/assets/docs/res_200.pdf?r=false> TE Connectivity/Holsworthy RN73 Series <https://www.mouser.com/datasheet/2/418/4/NG_DS_1773270_M-604713.pdf> Vishay Dale D/CRCW e3 <https://www.mouser.com/datasheet/2/427/dcrcwe3-1762152.pdf> Ohmite B20 <https://www.ohmite.com/assets/docs/res_200.pdf?r=false>; DKPN: P1.13KHCT-ND; MANUFACTURER: Panasonic Electronic Components; MOPN: 667-ERJ-3EKF1131V; MPN: ERJ-3EKF1131V; POWER: 0.1W; RESISTANCE: 1.13k; TOLERANCE: 1%; VOLTAGE_CONTINUOUS: 75V; VOLTAGE_MAX: 150V
R63 R69 = HyTechDevices:RESISTOR_?_*: Resistor PWR163 Series <https://www.mouser.com/datasheet/2/54/pwr163-777985.pdf> AC Series <https://www.mouser.com/datasheet/2/447/Yageo_PYu_AC_51_RoHS_L_7_1714230-1874691.pdf> PU Series <https://www.mouser.com/datasheet/2/447/PYu-PU_51_RoHS_L_6-1504619.pdf> ERA Series <https://www.mouser.com/datasheet/2/315/AOA0000C307-1149632.pdf> PWR263 Series <https://www.mouser.com/datasheet/2/54/pwr263s_35-778069.pdf> KTR Series <https://www.mouser.com/datasheet/2/348/ROHM_S_A0011075115_1-2563276.pdf> RC Series <https://www.mouser.com/datasheet/2/447/Yageo_03_18_2021_PYu_RC_Group_51_RoHS_L_11-2199992.pdf> ERJ PB3, PB6 Series <https://www.mouser.com/datasheet/2/315/AOA0000C328-1530132.pdf> ERJ PA2, P03, PA3, P06, P08, P14 Series <https://www.mouser.com/datasheet/2/315/AOA0000C331-1141874.pdf> B20 Series <https://www.ohmite.com/assets/docs/res_200.pdf?r=false> TE Connectivity/Holsworthy RN73 Series <https://www.mouser.com/datasheet/2/418/4/NG_DS_1773270_M-604713.pdf> Vishay Dale D/CRCW e3 <https://www.mouser.com/datasheet/2/427/dcrcwe3-1762152.pdf> Ohmite B20 <https://www.ohmite.com/assets/docs/res_200.pdf?r=false>; DKPN: P10.2KDBCT-ND; MANUFACTURER: Panasonic Electronic Components; MOPN: 667-ERA-3AEB1022V; MPN: ERA-3AEB1022V; POWER: 0.1W; RESISTANCE: 10.2k; TOLERANCE: 0.1%; VOLTAGE_CONTINUOUS: 31.94V; VOLTAGE_MAX: 75V
TP1-TP6 = HyTechDevices:TEST_POINT: Test Point for Probing; DKPN: 36-5015CT-ND; MANUFACTURER: Keystone Electronics; MOPN: 534-5015; MPN: 5015
U1 = HyTechDevices:VOLTAGE_REGULATOR_?_*: Voltage Regulators LDL1117S50R Datasheet <https://www.mouser.com/datasheet/2/389/dm00366442-1799212.pdf> NCP785AH120T1G <https://www.mouser.com/datasheet/2/308/NCP785A_D-1812704.pdf> LMS8117A Datasheet <https://www.ti.com/lit/ds/symlink/lms8117a.pdf?HQS> ST732M50R Datasheet <https://www.mouser.com/datasheet/2/389/st732-1830546.pdf>; DKPN: LMS8117AMP-3.3/NOPBCT-ND; MANUFACTURER: Texas Instruments; MOPN: 926-LMS8117AMP33NOPB; MPN: LMS8117AMP-3.3/NOPB
U2-U4 U33 U45 U46 = HyTechDevices:TCAN1051*V-Q1: TCAN1051*V Can Tranciever Datasheet <https://www.ti.com/lit/ds/symlink/tcan1051hgv-q1.pdf?HQS=dis-mous-null-mousermode-dsf-pf-null-wwe&ts=1610765132518&ref_url=https%253A%252F%252Fwww.mouser.com%252Ff>; DKPN: 296-49935-1-ND; MANUFACTURER: Texas Instruments; MOPN: 595-TCAN1051HGVDQ1; MPN: TCAN1051HGVDRQ1
U5 = HyTechDevices:ADM8316: ADM8316 Watchdog Datasheet <https://www.mouser.com/datasheet/2/609/adm8316_8318_8319_8320_8321_8322-1503275.pdf>; DKPN: ADM8316WBX30ARJZR7TR-ND; MANUFACTURER: Analog Devices Inc.; MOPN: 584-M8316WBX30ARJZR7; MPN: ADM8316WBX30ARJZR7; RESET_VOLTAGE: 3V; TIMEOUT: 102ms
U6 U7 U23 U32 = HyTechDevices:ADC128S022: ADC128S022 8-channel Analog to Digital Regulator Datasheet <https://www.ti.com/lit/ds/symlink/adc128s022.pdf?ts=1609290895378&ref_url=https%253A%252F%252Fwww.ti.com%252Fproduct%252FADC128S022%253Fqgpn%253Dadc128s022>; DKPN: 296-38561-1-ND; MANUFACTURER: Texas Instruments; MOPN: 926-A128S022CIMTXNPB; MPN: ADC128S022CIMTX/NOPB
U34 U37 U39 U41 U43 = HyTechDevices:OPAMP_1_CHANNEL_*: Op-Amp 1 Channel OPA991 Datasheet <https://www.ti.com/lit/ds/symlink/opa991.pdf?ts=1615503614502> Note: OPA991 is also a comparator; DKPN: 296-OPA991IDCKRCT-ND; MANUFACTURER: Texas Instruments; MOPN: 595-OPA991IDCKR; MPN: OPA991IDCKR
U38 = HyTechDevices:LOGICGATE_OR: OR Gate SN74LVC Datasheet <https://www.ti.com/lit/ds/symlink/sn74lvc1g34.pdf>; DKPN: 296-22348-2-ND; MANUFACTURER: Texas Instruments; MOPN: 595-SN74LVC32IDCKREP; MPN: SN74LVC1G32IDCKREP
U42 = HyTechDevices:LOGICGATE_AND_: AND Gate SN74LVC Datasheet <https://www.ti.com/lit/ds/symlink/sn74lvc1g08.pdf>; DKPN: 296-SN74LVC1G08DCK3TR-ND; MANUFACTURER: Texas Instruments; MOPN: 595-SN74LVC1G08DCK3; MPN: SN74LVC1G08DCK3
U44 = HyTechDevices:LOGICGATE_NOR: NOR Gate SN74LVC Datasheet <https://www.ti.com/lit/ds/symlink/sn74lvc1g02.pdf>; DKPN: 296-11598-1-ND; MANUFACTURER: Texas Instruments; MOPN: 595-SN74LVC1G02DCKR; MPN: SN74LVC1G02DCKR
VR1 = HyTechDevices:RESISTOR_TRIMPOT_*_?: Variable Resistor Bourns 3362P Datasheet <https://www.mouser.com/datasheet/2/54/3362-776956.pdf>; DKPN: 3362P-103LF-ND; MANUFACTURER: Bourns Inc.; MOPN: 652-3362P-1-103LF; MPN: 3362P-1-103LF; POWER: 0.5W; RESISTANCE: 10k; TOLERANCE: 10%; VOLTAGE: 70.711V
XA1 = HyTechDevices:ULTIMATE_GPS: Adafruit Ultimate GPS Breakout - 66 channel w/10 Hz updates - Version 3 Datasheet <https://www.mouser.com/datasheet/2/737/adafruit_ultimate_gps-779243.pdf> Requires ordering of: 2: 5mm height, 3mm screw standoffs 1: Ultimate GPS 1: Antenna; DKPN: DW-09-07-G-S-200-ND; MANUFACTURER: Samtec Inc.; MOPN: 200-DW0907GS200; MPN: DW-09-07-G-S-200
XB1 = HyTechDevices:BATTERY_HOLDER_*: Keystone 498 1/3N Cell Holder PN for the holder; if 1/3N batteries needed, order separately. Datasheet <https://www.mouser.com/datasheet/2/215/98-745913.pdf>; BATTERY_TYPE: 1/3N; DKPN: 36-498-ND; MANUFACTURER: Keystone Electronics; MOPN: 534-498; MPN: 498
XF2 = HyTechDevices:FUSE_HOLDER_*: Fuse Holder All PNs for the holder; if Miniblade Fuses <https://www.littelfuse.com/media?resourcetype=datasheets&itemid=0f5f58cb-559e-494b-8d53-723f30445ae5&filename=littelfuse-mini-datasheet> needed, order separately. Mini-Blade PTH <https://www.mouser.com/datasheet/2/215/3568-742601.pdf> Mini-Blade SMD <https://www.mouser.com/datasheet/2/215/588-744913.pdf>; DKPN: 36-3588-ND; FUSE_TYPE: MINI 297; MANUFACTURER: Keystone Electronics; MOPN: 534-3588; MPN: 3588